# EasyEDA Pro project spark-switch.epro, schematic ethernet_switch

## Sheets
1 RJ45 Ports: Board Name: ethernet_switch; Create Date: 2026-02-01; Page Name: RJ45 Ports; Project Name: ethernet_switch; Schematic Name: ethernet_switch; Update Date: 2026-02-21; Company: EasyEDA.com; Page Size: A4; Version: V1.0
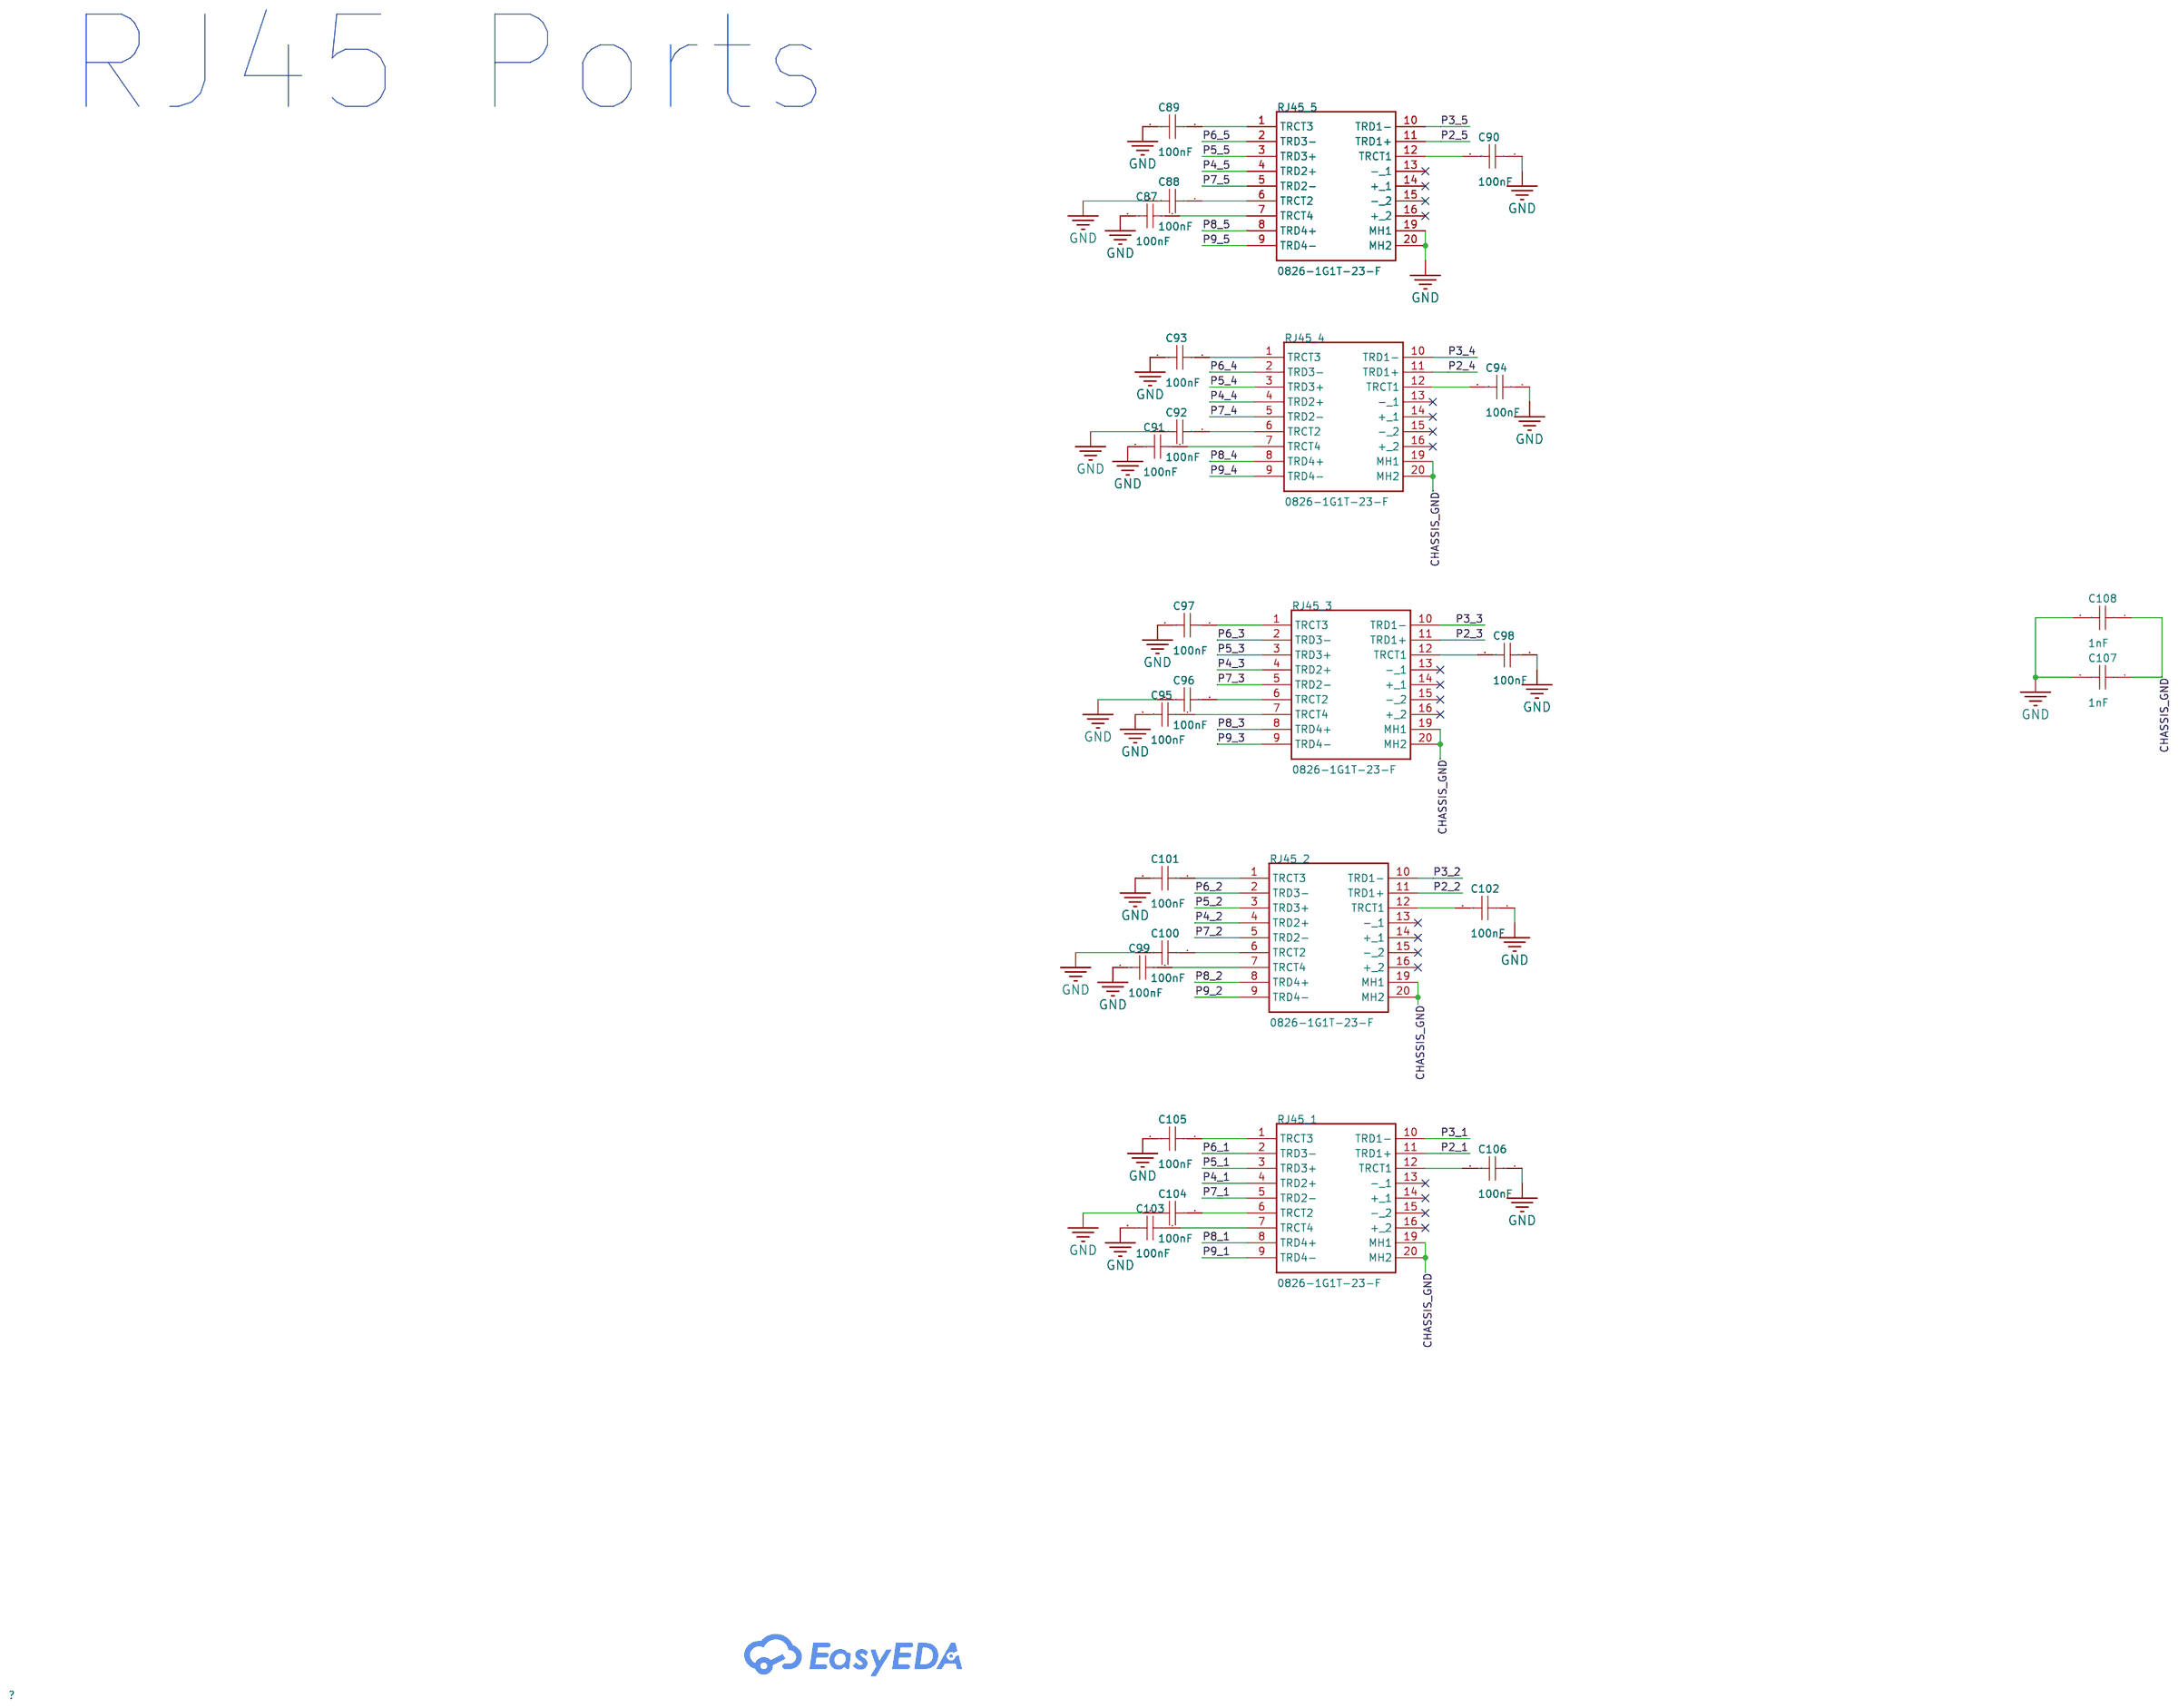
[diagram p0: RJ45 Ports]
2 Switch IC: Create Date: 2026-02-02; Page Name: Switch IC; Update Date: 2026-02-22
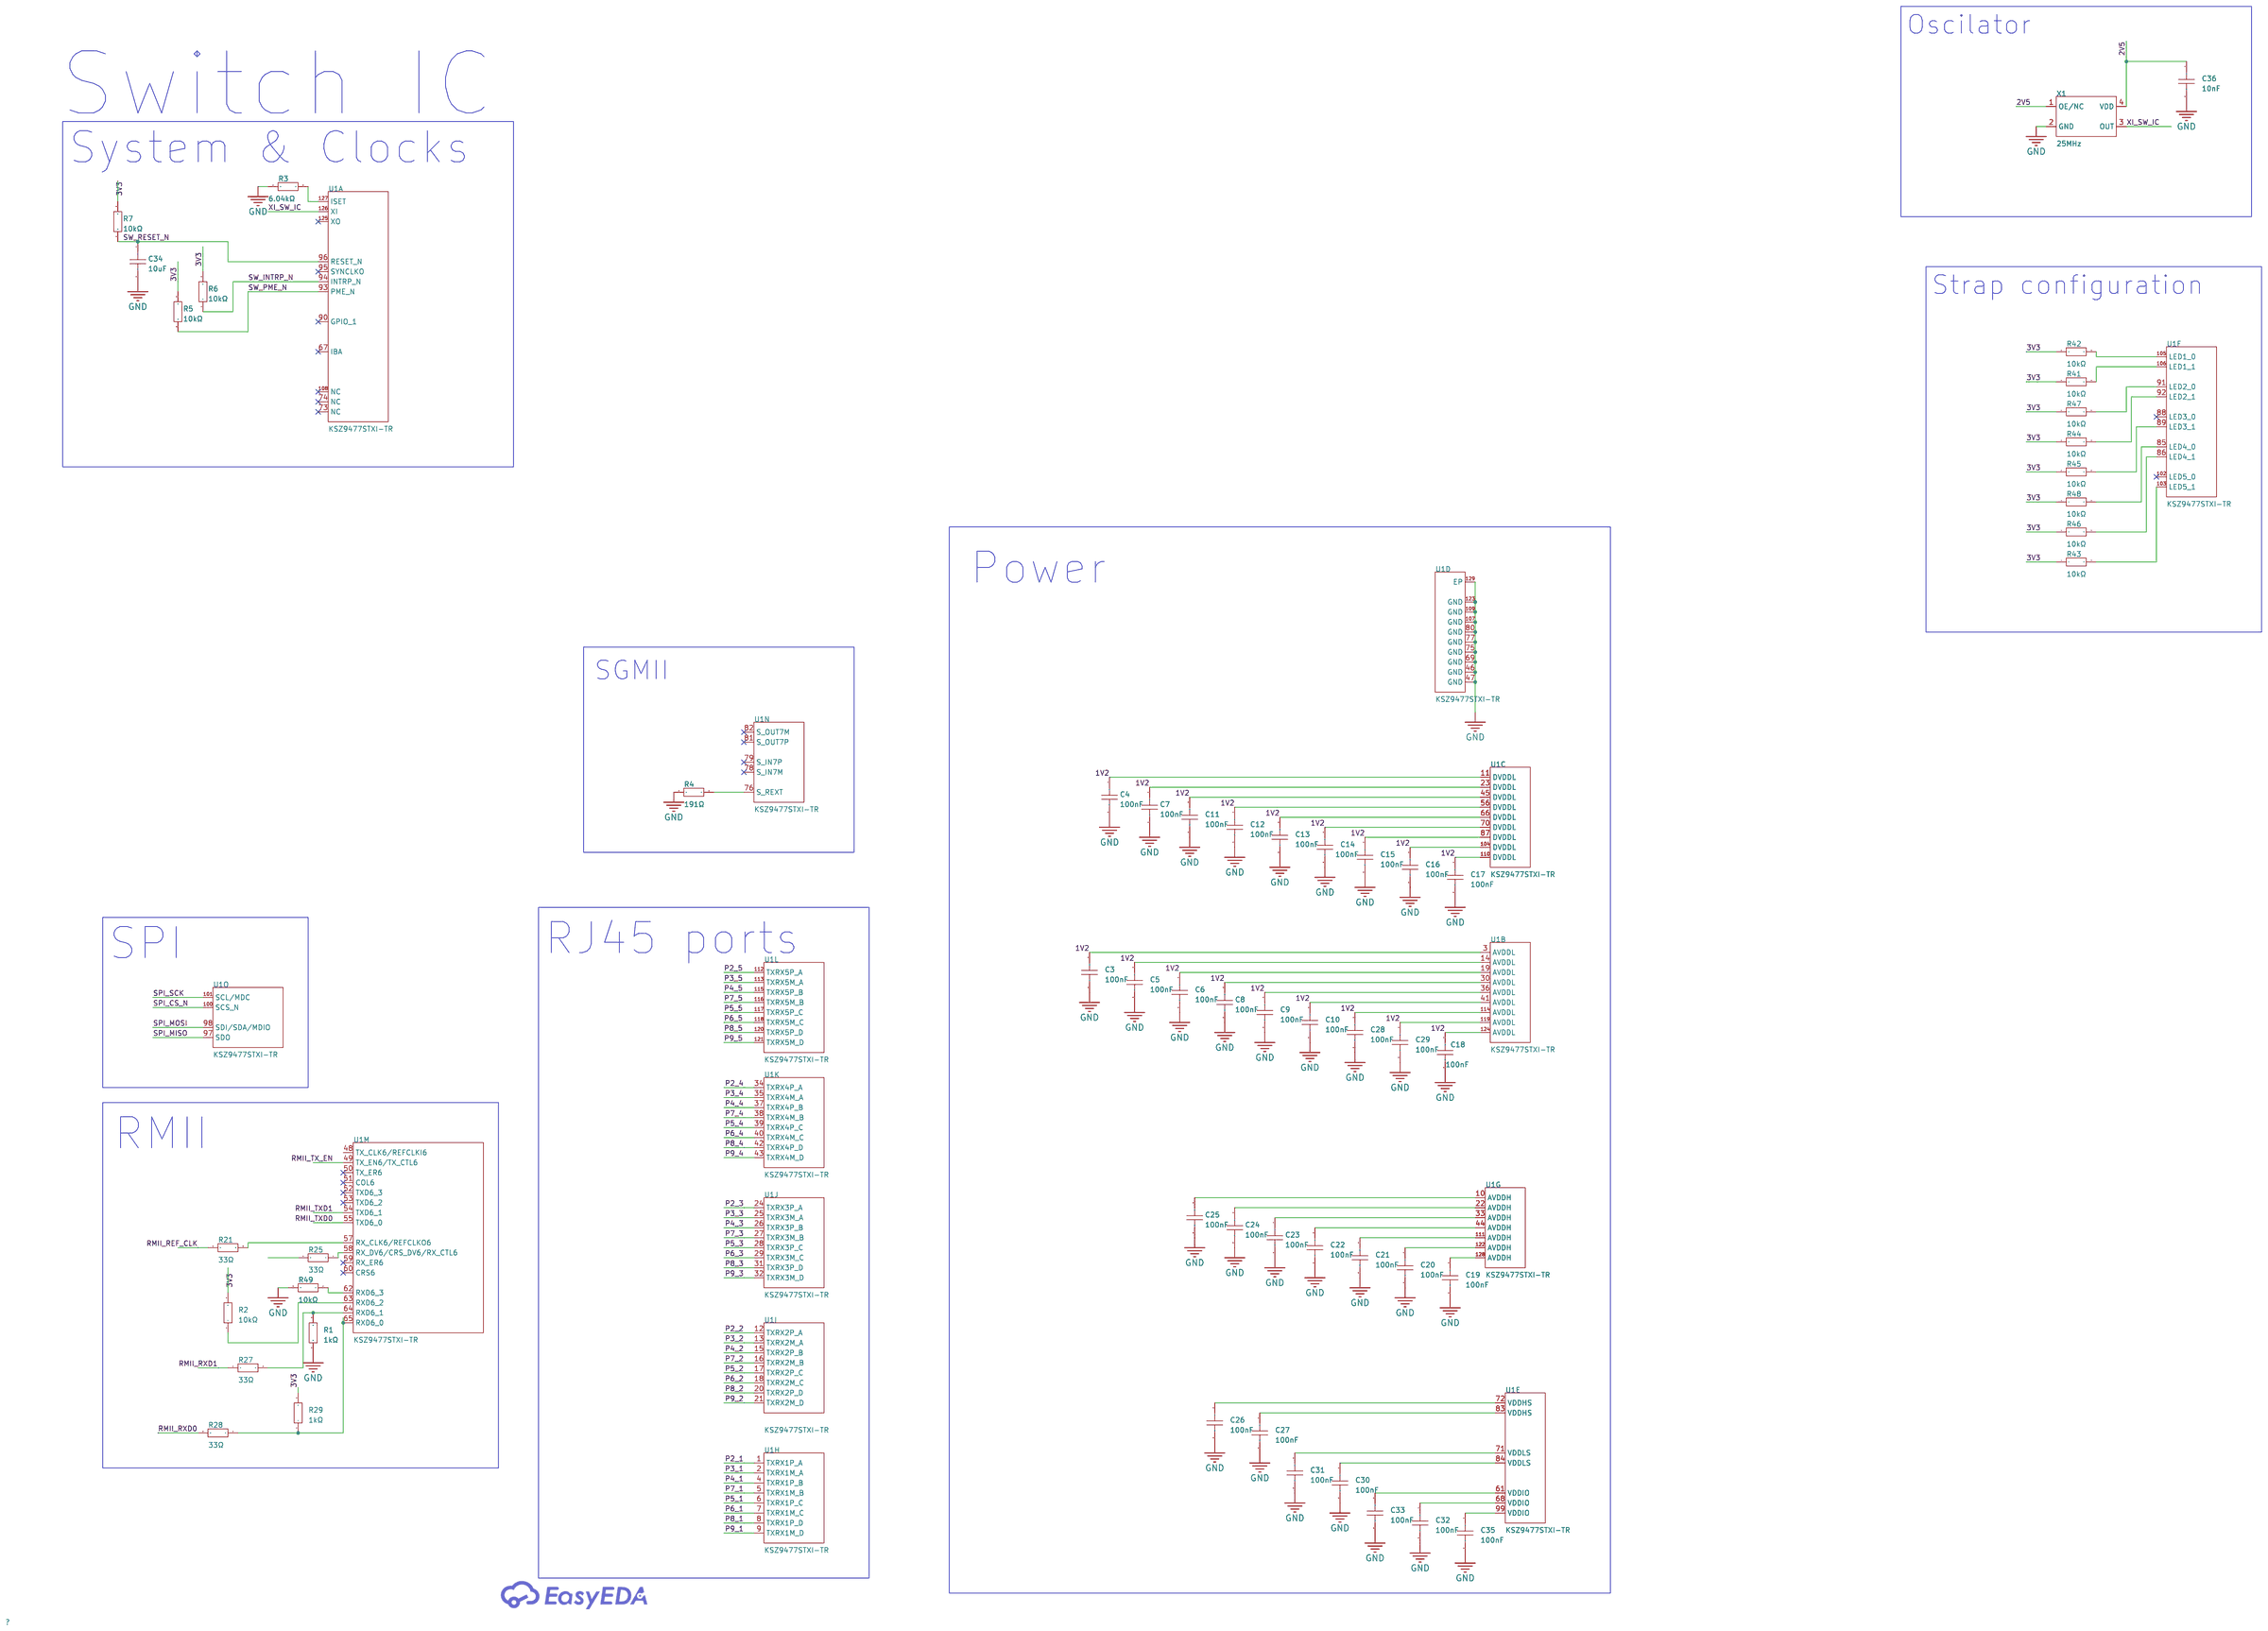
[diagram p1: Switch IC]
3 MCU: Create Date: 2026-02-02; Page Name: MCU; Update Date: 2026-02-22
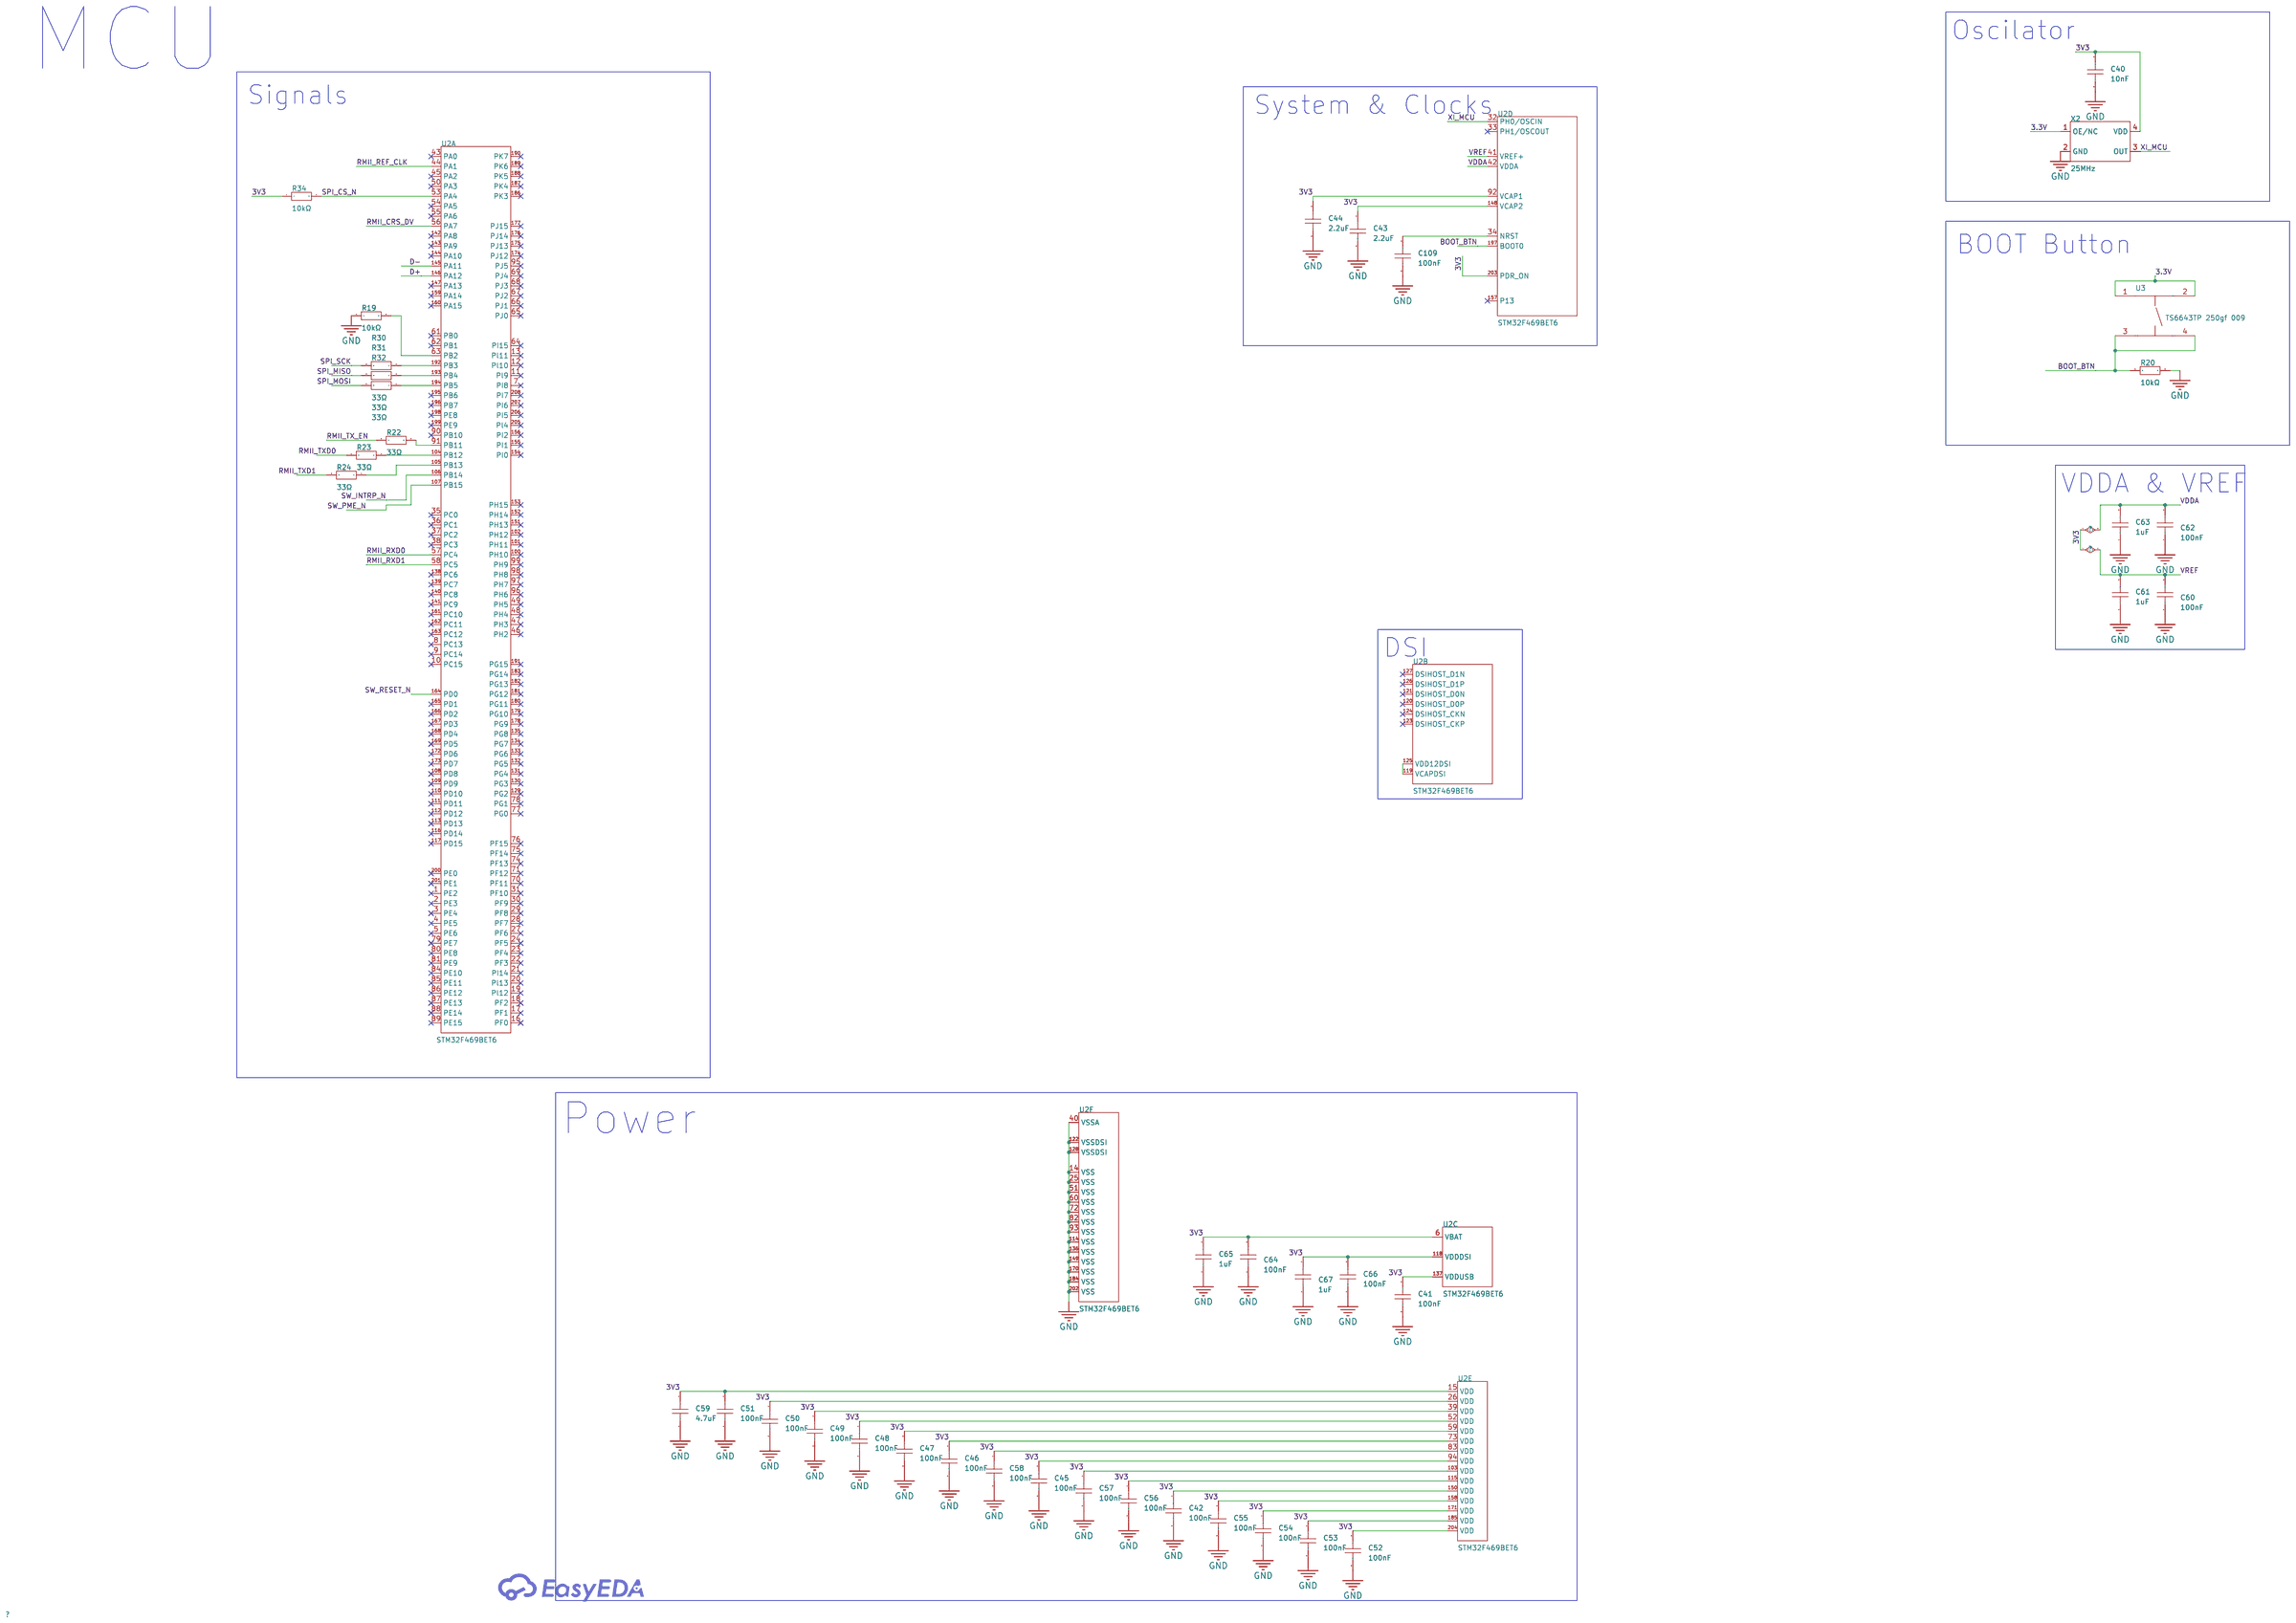
[diagram p2: MCU]
4 Power: Create Date: 2026-02-14; Page Name: Power; Update Date: 2026-02-18
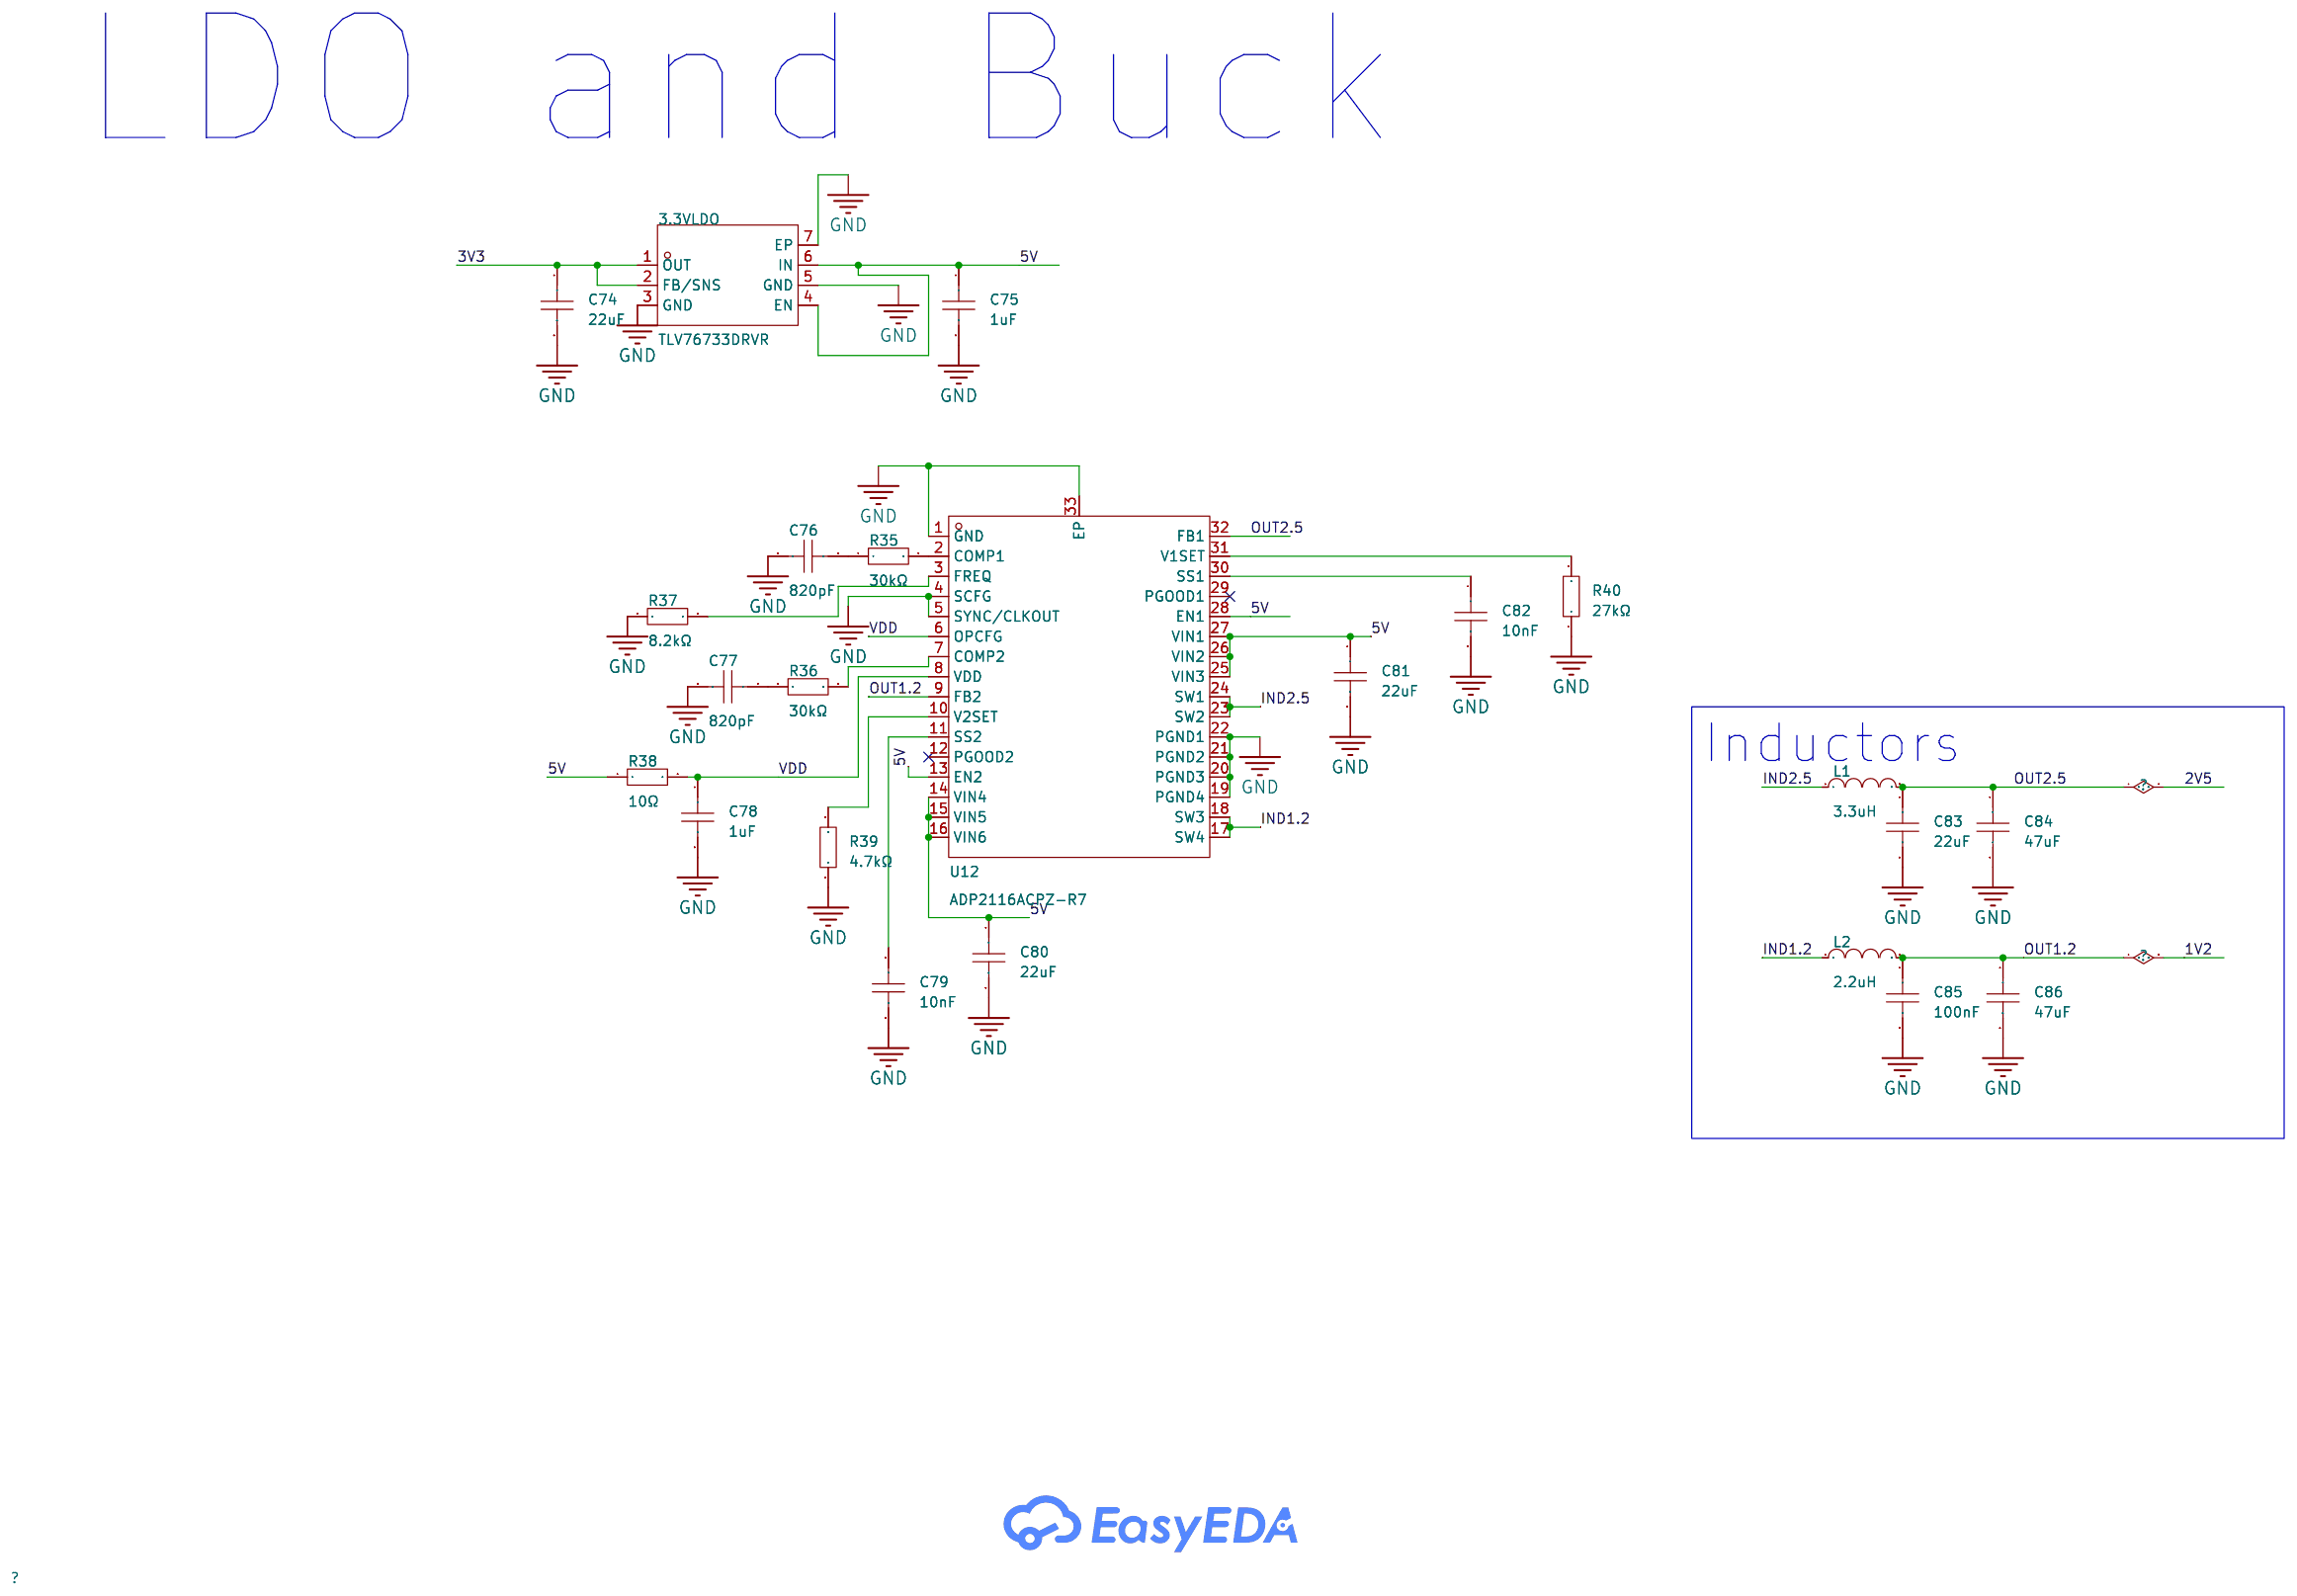
[diagram p3: Power]
5 USB+ESD: Create Date: 2026-02-15; Page Name: USB+ESD; Update Date: 2026-02-17
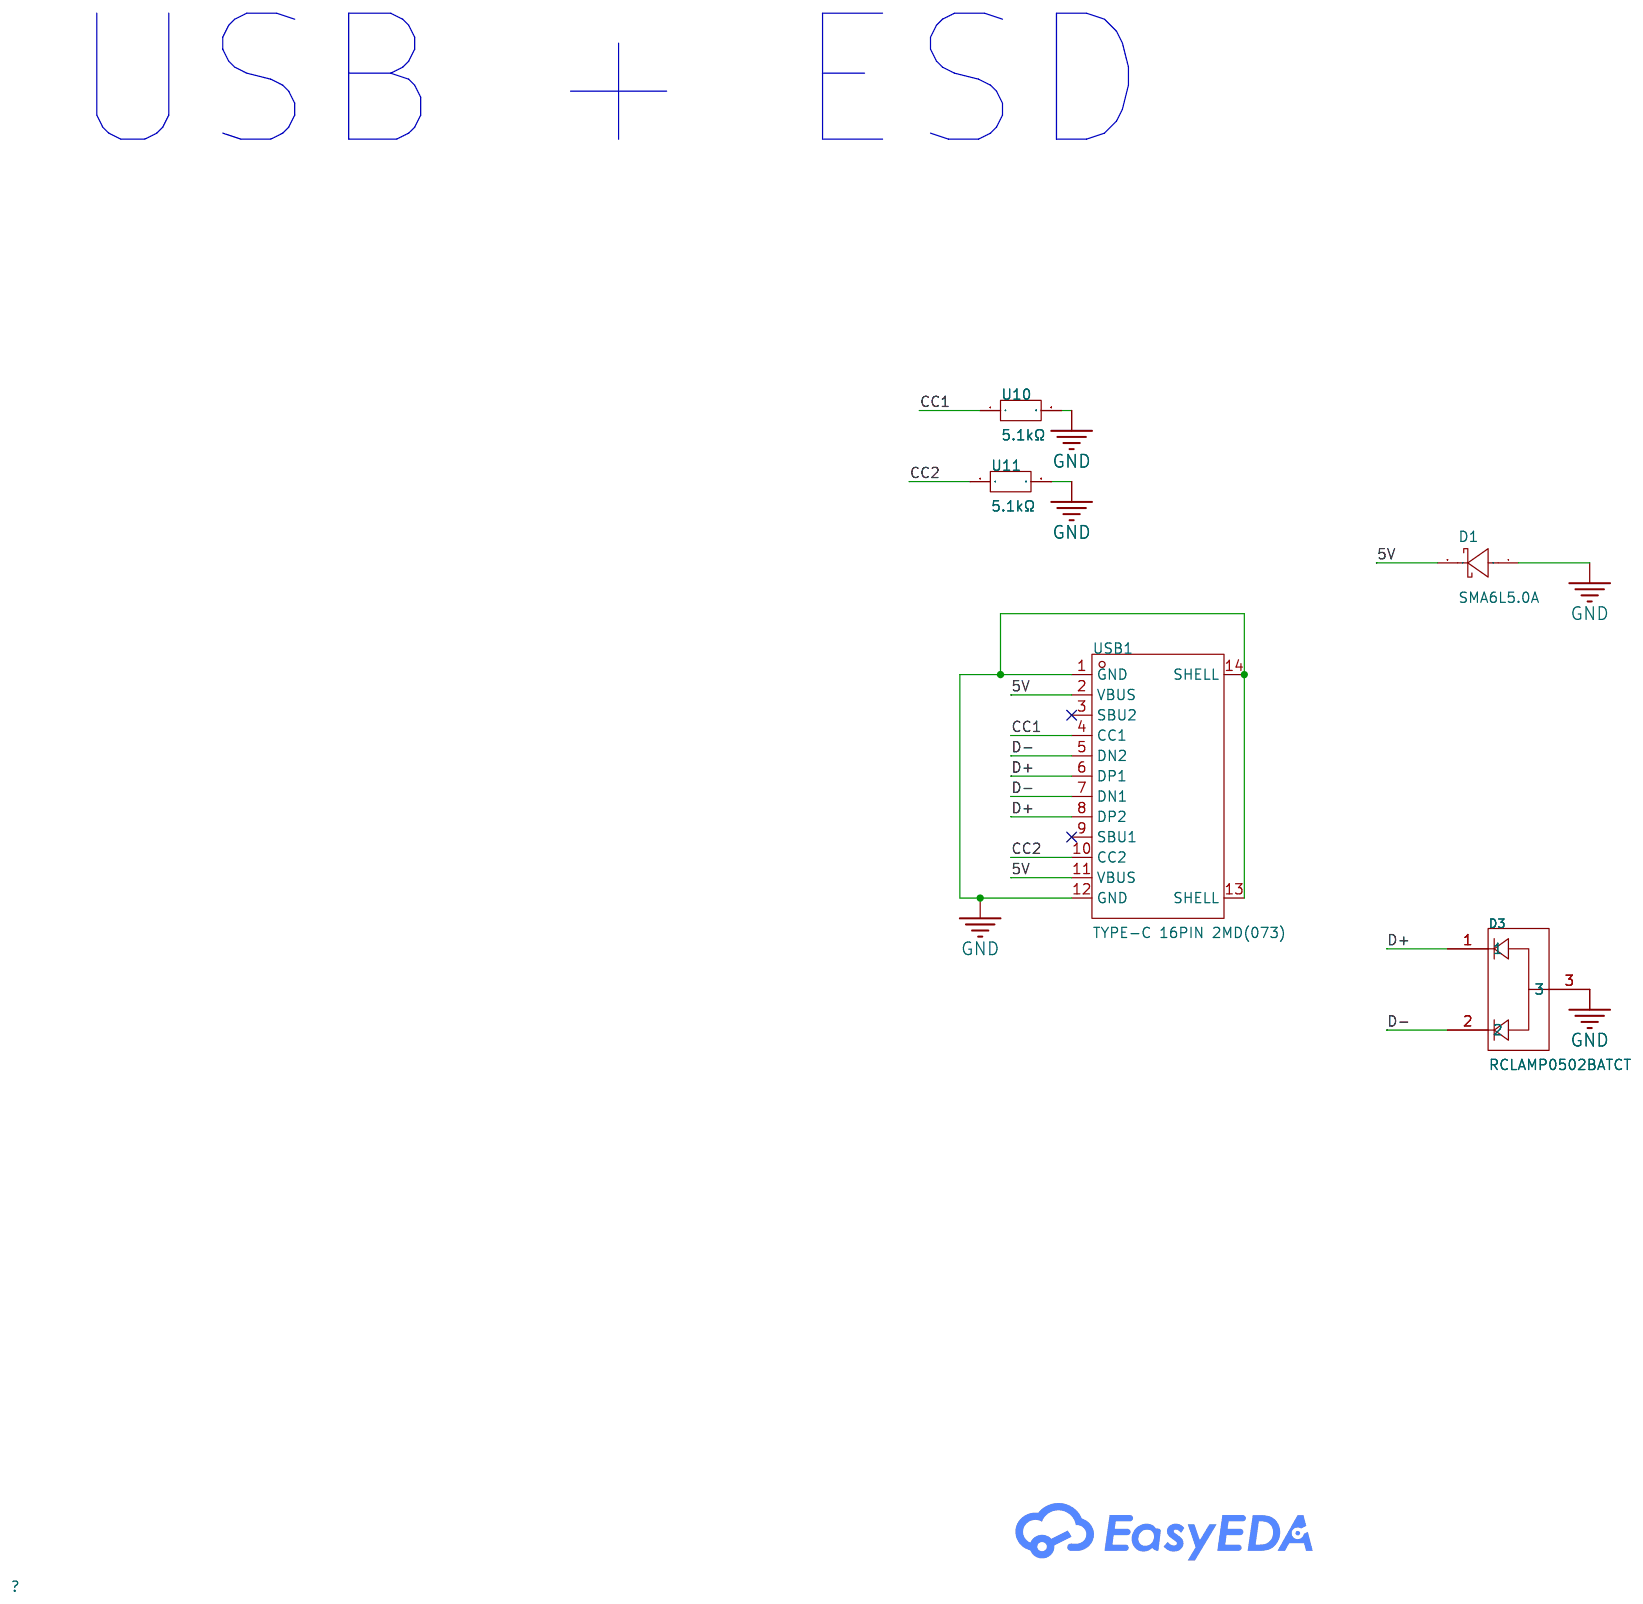
[diagram p4: USB+ESD]

## Parts
sheet MCU
C40  10nF  [C0603]
C41  100nF  [C0603]
C42  100nF  [C0603]
C43  2.2uF  [C0603]
C44  2.2uF  [C0603]
C45  100nF  [C0603]
C46  100nF  [C0603]
C47  100nF  [C0603]
C48  100nF  [C0603]
C49  100nF  [C0603]
C50  100nF  [C0603]
C51  100nF  [C0603]
C52  100nF  [C0603]
C53  100nF  [C0603]
C54  100nF  [C0603]
C55  100nF  [C0603]
C56  100nF  [C0603]
C57  100nF  [C0603]
C58  100nF  [C0603]
C59  4.7uF  [C0603]
C60  100nF  [C0603]
C61  1uF  [C0603]
C62  100nF  [C0603]
C63  1uF  [C0603]
C64  100nF  [C0603]
C65  1uF  [C0603]
C66  100nF  [C0603]
C67  1uF  [C0603]
C109  100nF  [C0603]
R19  10kΩ  [R0603]
R20  10kΩ  [R0603]
R22  33Ω  [R0603]
R23  33Ω  [R0603]
R24  33Ω  [R0603]
R30  33Ω  [R0603]
R31  33Ω  [R0603]
R32  33Ω  [R0603]
R34  10kΩ  [R0603]
U2  STM32F469BET6  [LQFP-208_L28.0-W28.0-P0.50-LS30.0-BL]  (sections 1,DSI,Other_Power,System_&_Clocks,VDD,VSS)
U3  TS6643TP 250gf 009  [SW-SMD_4P-L6.2-W6.0-P4.50-LS9.0]
X2  25MHz  [OSC-SMD_4P-L2.0-W1.6-BL_8NE]
sheet Power
3.3VLDO  TLV76733DRVR  [WSON-6_L2.0-W2.0-P0.65-TL-EP]
C74  22uF  [C0603]
C75  1uF  [C0603]
C76  820pF  [C0603]
C77  820pF  [C0603]
C78  1uF  [C0603]
C79  10nF  [C0603]
C80  22uF  [C0603]
C81  22uF  [C0603]
C82  10nF  [C0603]
C83  22uF  [C1210]
C84  47uF  [C1210]
C85  100nF  [C1210]
C86  47uF  [C1210]
L1  3.3uH  [IND-SMD_L5.5-W5.3]
L2  2.2uH  [IND-SMD_L5.4-W5.2]
R35  30kΩ  [R0603]
R36  30kΩ  [R0603]
R37  8.2kΩ  [R0603]
R38  10Ω  [R0603]
R39  4.7kΩ  [R0603]
R40  27kΩ  [R0603]
U12  ADP2116ACPZ-R7  [LFCSP-32_L5.0-W5.0-P0.50-BL-EP3.1]
sheet RJ45 Ports
C87  100nF  [C0603]
C88  100nF  [C0603]
C89  100nF  [C0603]
C90  100nF  [C0603]
C91  100nF  [C0603]
C92  100nF  [C0603]
C93  100nF  [C0603]
C94  100nF  [C0603]
C95  100nF  [C0603]
C96  100nF  [C0603]
C97  100nF  [C0603]
C98  100nF  [C0603]
C99  100nF  [C0603]
C100  100nF  [C0603]
C101  100nF  [C0603]
C102  100nF  [C0603]
C103  100nF  [C0603]
C104  100nF  [C0603]
C105  100nF  [C0603]
C106  100nF  [C0603]
C107  1nF  [C1808]
C108  1nF  [C1808]
RJ45_1  0826-1G1T-23-F  [08261G1T23F]
RJ45_2  0826-1G1T-23-F  [08261G1T23F]
RJ45_3  0826-1G1T-23-F  [08261G1T23F]
RJ45_4  0826-1G1T-23-F  [08261G1T23F]
RJ45_5  0826-1G1T-23-F  [08261G1T23F]
sheet Switch IC
C3  100nF  [C0603]
C4  100nF  [C0603]
C5  100nF  [C0603]
C6  100nF  [C0603]
C7  100nF  [C0603]
C8  100nF  [C0603]
C9  100nF  [C0603]
C10  100nF  [C0603]
C11  100nF  [C0603]
C12  100nF  [C0603]
C13  100nF  [C0603]
C14  100nF  [C0603]
C15  100nF  [C0603]
C16  100nF  [C0603]
C17  100nF  [C0603]
C18  100nF  [C0603]
C19  100nF  [C0603]
C20  100nF  [C0603]
C21  100nF  [C0603]
C22  100nF  [C0603]
C23  100nF  [C0603]
C24  100nF  [C0603]
C25  100nF  [C0603]
C26  100nF  [C0603]
C27  100nF  [C0603]
C28  100nF  [C0603]
C29  100nF  [C0603]
C30  100nF  [C0603]
C31  100nF  [C0603]
C32  100nF  [C0603]
C33  100nF  [C0603]
C34  10uF  [C0603]
C35  100nF  [C0603]
C36  10nF  [C0603]
R1  1kΩ  [R0603]
R2  10kΩ  [R0603]
R3  6.04kΩ  [R0603]
R4  191Ω  [R0603]
R5  10kΩ  [R0603]
R6  10kΩ  [R0603]
R7  10kΩ  [R0603]
R21  33Ω  [R0603]
R25  33Ω  [R0603]
R27  33Ω  [R0603]
R28  33Ω  [R0603]
R29  1kΩ  [R0603]
R41  10kΩ  [R0603]
R42  10kΩ  [R0603]
R43  10kΩ  [R0603]
R44  10kΩ  [R0603]
R45  10kΩ  [R0603]
R46  10kΩ  [R0603]
R47  10kΩ  [R0603]
R48  10kΩ  [R0603]
R49  10kΩ  [R0603]
U1  KSZ9477STXI-TR  [TQFP-128_L14.0-W14.0-P0.40-LS16.0-BL-EP]  (sections 1,Analog_Core_Power,Digital_Core_Power,GND,Interfaces_Power,LED,PHY1,PHY2,PHY3,PHY4,PHY5,PHY_&_Clock_Power,Port_6,SGMII,SPI)
X1  25MHz  [OSC-SMD_4P-L2.0-W1.6-BL_8NE]
sheet USB+ESD
D1  SMA6L5.0A  [SMA_L4.3-W2.6-LS5.2-R-RD]
D3  RCLAMP0502BATCT  [SC-75-3_L1.6-W0.8-P1.00-LS1.6-BR]
U10  5.1kΩ  [R0603]
U11  5.1kΩ  [R0603]
USB1  TYPE-C 16PIN 2MD(073)  [USB-C-SMD_TYPE-C-6PIN-2MD-073]

## Library data of the parts
C36 C40 C79 C82 = CC0603JRNPO8BN103: Capacitance:10nF Tolerance:±5% Tolerance:±5% Voltage Rating:25V Temperature Coefficient:NP0; LCSC Part Name: 10nF ±5% 25V; Supplier Part: C723749; Manufacturer: YAGEO(国巨); Supplier Footprint: 0603; JLCPCB Part Class: Extended Part; Datasheet: https://item.szlcsc.com/datasheet/CC0603JRNPO8BN103/768440.html; Supplier: LCSC; Tolerance: ±5%; Voltage Rating: 25V; Temperature Coefficient: NP0
C3-C33 C35 C41 C42 C45-C58 C60 C62 C64 C66 = CL10B104KA8NNNC: Capacitance:100nF Tolerance:±10% Tolerance:±10% Voltage Rating:25V Temperature Coefficient:X7R; LCSC Part Name: 100nF ±10% 25V; Supplier Part: C1590; Manufacturer: SAMSUNG(三星); Supplier Footprint: 0603; JLCPCB Part Class: Extended Part; Datasheet: https://item.szlcsc.com/datasheet/CL10B104KA8NNNC/1942.html; Supplier: LCSC; Tolerance: ±10%; Voltage Rating: 25V; Temperature Coefficient: X7R
C43 C44 = CGA0603X5R225K250JT: Capacitance:2.2uF Tolerance:±10% Tolerance:±10% Voltage Rating:25V Temperature Coefficient:X5R; LCSC Part Name: 2.2uF ±10% 25V; Supplier Part: C6119859; Manufacturer: HRE(芯声); Supplier Footprint: 0603; JLCPCB Part Class: Extended Part; Datasheet: https://item.szlcsc.com/datasheet/CGA0603X5R225K250JT/7062565.html; Supplier: LCSC; Tolerance: ±10%; Voltage Rating: 25V; Temperature Coefficient: X5R
C59 = CL10A475KA8NQNC: Capacitance:4.7uF Tolerance:±10% Tolerance:±10% Voltage Rating:25V Temperature Coefficient:X5R; LCSC Part Name: 4.7uF ±10% 25V; Supplier Part: C69335; Manufacturer: SAMSUNG(三星); Supplier Footprint: 0603; JLCPCB Part Class: Extended Part; Datasheet: https://item.szlcsc.com/datasheet/CL10A475KA8NQNC/70449.html; Supplier: LCSC; Tolerance: ±10%; Voltage Rating: 25V; Temperature Coefficient: X5R
C61 C63 C65 C67 C75 C78 = CL10B105KB8NQNC: Capacitance:1uF Tolerance:±10% Tolerance:±10% Voltage Rating:50V Temperature Coefficient:X7R; LCSC Part Name: 1uF ±10% 50V; Supplier Part: C5199872; Manufacturer: SAMSUNG(三星); Supplier Footprint: 0603; JLCPCB Part Class: Extended Part; Datasheet: https://item.szlcsc.com/datasheet/CL10B105KB8NQNC/5885909.html; Supplier: LCSC; Tolerance: ±10%; Voltage Rating: 50V; Temperature Coefficient: X7R
C87-C106 C109 = CAP_0603: Supplier Footprint: 0603
R2 R5-R7 R19 R20 R34 R41-R49 = RC0603FR-0710KL: Type:Thick Film Resistors Resistance: Tolerance:±1% Tolerance:±1% Power(Watts): Overload Voltage (Max): Temperature Coefficient:±100ppm/℃ Temperature Coefficient:±100ppm/℃ Operating Temperature Range:-55℃~+155℃ Operating Temperature Range:-55℃~+155℃; LCSC Part Name: 厚膜电阻 10kΩ ±1% 100mW; Supplier Part: C98220; Manufacturer: YAGEO(国巨); Supplier Footprint: 0603; JLCPCB Part Class: Extended Part; Datasheet: https://atta.szlcsc.com/upload/public/pdf/source/20180927/C295883_E8D83085EA81BD7DE0B2B681138C15EE.pdf; Supplier: LCSC; Type: Thick Film Resistors; Tolerance: ±1%; Temperature Coefficient: ±100ppm/℃; Operating Temperature Range: -55℃~+155℃
R21-R25 R27 R28 R30-R32 = FRC0603F33R0TS: Type:Thick Film Resistor Resistance:33Ω Tolerance:±1% Tolerance:±1% Power(Watts):100mW Voltage-Supply(Max):75V Temperature Coefficient:±100ppm/℃ Temperature Coefficient:±100ppm/℃ Operating Temperature:-55℃~+155℃ Operating Temperature:-55℃~+155℃; LCSC Part Name: 33Ω ±1% 100mW 厚膜电阻; Supplier Part: C2909394; Manufacturer: FOJAN(富捷); Supplier Footprint: 0603; JLCPCB Part Class: Extended Part; Supplier: LCSC; Type: Thick Film Resistor; Tolerance: ±1%; Power(Watts): 100mW; Voltage-Supply(Max): 75V; Temperature Coefficient: ±100ppm/℃; Operating Temperature: -55℃~+155℃
U2 = STM32F469BET6: CPU Core:ARM-M4 CPU Maximum Speed:180MHz Program Storage Size:512KB Program Memory Type:FLASH Number of I/O:161 ADC (Bit):12bit DAC (Bit):12bit Voltage - Supply:1.7V~3.6V Voltage - Supply:1.7V~3.6V Applications:-; LCSC Part Name: 带DSP和FPU的高性能高级系列ARM Cortex-M4 MCU，具有512 KB Flash、180 MHz CPU、ART加速器、Chrom-ART加速器、TFT、带SDRAM的FMC、双QSPI、TFT和MIPI-DSI; Supplier Part: C1342980; Manufacturer: ST(意法半导体); Supplier Footprint: LQFP-208(28x28); JLCPCB Part Class: Extended Part; Datasheet: https://item.szlcsc.com/datasheet/STM32F469BET6/1433262.html; Supplier: LCSC; CPU Core: ARM-M4; CPU Maximum Speed: 180MHz; Program Storage Size: 512KB; Program Memory Type: FLASH; Number of I/O: 161; ADC (Bit): 12bit; DAC (Bit): 12bit; Voltage - Supply: 1.7V~3.6V
U3 = TS6643TP 250gf 009: Circuit:SPST Actuator Style:Round Button Operating Force:2.5N Mounting Type:Surface Mount,Vertical Length:6mm Width:6mm Switch Height:4.3mm with Bracket:Without Bracket Contact Current:50mA Voltage Rating:12V Actuator/Cap Color:Black With Lamp:No IP Ratin; LCSC Part Name: 6*6*4.3mm 立贴 轻触开关; Supplier Part: C5342967; Manufacturer: SHOU HAN(首韩); Supplier Footprint: SMD,6x6mm; JLCPCB Part Class: Extended Part; Datasheet: https://item.szlcsc.com/datasheet/TS6643TP%2520250gf%2520009/6118870.html; Supplier: LCSC; Circuit: SPST; Actuator Style: Round Button; Operating Force: 2.5N; Mounting Type: Surface Mount,Vertical; Length: 6mm; Width: 6mm; Switch Height: 4.3mm; with Bracket: Without Bracket; Contact Current: 50mA; Voltage Rating: 12V; Actuator/Cap Color: Black; With Lamp: No; Life: 100,000 Cycles; Operating Temperature: -25℃~+70℃
X1 X2 = SX1M25.000M10F30TNN: Frequency:25MHz Normal temperature Frequency Tolerance:±10ppm Normal temperature Frequency Tolerance:±10ppm Output Type:CMOS Voltage - Supply:1.62V~3.63V Voltage - Supply:1.62V~3.63V Current - Supply:10mA Frequency Stability:±30ppm Frequency Stability:±30; LCSC Part Name: 25MHz ±10ppm 1.62V~3.63V CMOS; Supplier Part: C2901612; Manufacturer: SCTF(星通时频); Supplier Footprint: SMD2016-4P; JLCPCB Part Class: Extended Part; Datasheet: https://item.szlcsc.com/datasheet/SX1M25.000M10F30TNN/3151425.html; Supplier: LCSC; Normal temperature Frequency Tolerance: ±10ppm; Output Type: CMOS; Voltage - Supply: 1.62V~3.63V; Current - Supply: 10mA; Frequency Stability: ±30ppm; Operating Temperature: -40℃~+85℃
3.3VLDO = TLV76733DRVR: Output Type:Fixed Maximum Input Voltage:16V Output Voltage:3.3V Output Voltage:3.3V Output Current:1A Power Supply Rejection Ratio (PSRR):70dB@(120Hz) Dropout Voltage:1.4V@(1A) standby current:80uA Feature:防静电保护；Soft Start；浪涌保护；低ESR；Thermal Protection(TSD; LCSC Part Name: 具有可调节输出和固定输出的 1A、16V 正电压低压降 (LDO) 线性稳压器; Supplier Part: C2848334; Manufacturer: TI(德州仪器); Supplier Footprint: WSON-6(2x2); JLCPCB Part Class: Extended Part; Datasheet: https://www.ti.com/cn/lit/gpn/tlv767; Supplier: LCSC; Output Type: Fixed; Maximum Input Voltage: 16V; Output Voltage: 3.3V; Output Current: 1A; Power Supply Rejection Ratio (PSRR): 70dB@(120Hz); Dropout Voltage: 1.4V@(1A); standby current: 80uA; Feature: 防静电保护；Soft Start；浪涌保护；低ESR；Thermal Protection(TSD)；欠压闭锁；Overcurrent Protection(OCP)；带使能；防倒灌; Operating Temperature: -40℃~+125℃@(Tj); Output Polarity: Positive electrode; Number of Outputs: 1
C74 C80 C81 = GRM188C61E226ME01D: Capacitance:22uF Tolerance:±20% Tolerance:±20% Voltage Rating:25V; LCSC Part Name: 22uF ±20% 25V; Supplier Part: C29519229; Manufacturer: muRata(村田); Supplier Footprint: 0603; JLCPCB Part Class: Extended Part; Datasheet: https://item.szlcsc.com/datasheet/GRM188C61E226ME01D/31245821.html; Supplier: LCSC; Tolerance: ±20%; Voltage Rating: 25V
C76 C77 = CC0603JRNPO8BN821: Capacitance:820pF Tolerance:±5% Tolerance:±5% Voltage Rating:25V Temperature Coefficient:NP0; LCSC Part Name: 820pF ±5% 25V; Supplier Part: C519398; Manufacturer: YAGEO(国巨); Supplier Footprint: 0603; JLCPCB Part Class: Extended Part; Datasheet: https://item.szlcsc.com/datasheet/CC0603JRNPO8BN821/536069.html; Supplier: LCSC; Tolerance: ±5%; Voltage Rating: 25V; Temperature Coefficient: NP0
C83 = CL32B226KAJNNNE: Capacitance:22uF Tolerance:±10% Tolerance:±10% Voltage Rating:25V Temperature Coefficient:X7R; LCSC Part Name: 22uF ±10% 25V; Supplier Part: C309062; Manufacturer: SAMSUNG(三星); Supplier Footprint: 1210; JLCPCB Part Class: Extended Part; Datasheet: https://item.szlcsc.com/datasheet/CL32B226KAJNNNE/292813.html; Supplier: LCSC; Tolerance: ±10%; Voltage Rating: 25V; Temperature Coefficient: X7R
C84 C86 = CS3225X7R476K100NRL: Capacitance:47uF Tolerance:±10% Tolerance:±10% Voltage Rating:10V Temperature Coefficient:X7R; LCSC Part Name: 47uF ±10% 10V; Supplier Part: C5189825; Manufacturer: SAMWHA(三和); Supplier Footprint: 1210; JLCPCB Part Class: Extended Part; Datasheet: https://item.szlcsc.com/datasheet/CS3225X7R476K100NRL/5869646.html; Supplier: LCSC; Tolerance: ±10%; Voltage Rating: 10V; Temperature Coefficient: X7R
C85 = C3225C0G1H104JT000N: Capacitance:100nF Tolerance:±5% Tolerance:±5% Voltage Rating:50V Temperature Coefficient:C0G; LCSC Part Name: 100nF ±5% 50V; Supplier Part: C338021; Manufacturer: TDK; Supplier Footprint: 1210; JLCPCB Part Class: Extended Part; Datasheet: https://item.szlcsc.com/datasheet/C3225C0G1H104JT000N/315814.html; Supplier: LCSC; Tolerance: ±5%; Voltage Rating: 50V; Temperature Coefficient: C0G
L1 = FEXL0530A-3R3M: Inductance:3.3uH Tolerance:±20% Tolerance:±20% Current Rating:8.1A Current - Saturation(Isat):9.5A DC Resistance(DCR):23.1mΩ Type:- Ratings:AEC-Q200; LCSC Part Name: 3.3uH ±20% 9.5A 合金扁线超大电流，一体成型电感; Supplier Part: C5378512; Manufacturer: cjiang(长江微电); Supplier Footprint: SMD,5.3x5.5mm; JLCPCB Part Class: Extended Part; Datasheet: https://item.szlcsc.com/datasheet/FEXL0530A-3R3M/6241704.html; Supplier: LCSC; Tolerance: ±20%; Current Rating: 8.1A; Current - Saturation(Isat): 9.5A; DC Resistance(DCR): 23.1mΩ; Ratings: AEC-Q200
L2 = APH0530T2R2M: Inductance:2.2uH Tolerance:±20% Tolerance:±20% Current Rating:7A Current - Saturation(Isat):7A DC Resistance(DCR):29mΩ Type:Molded Inductor Ratings:-; LCSC Part Name: 2.2uH ±20% 7A; Supplier Part: C5349681; Manufacturer: APV(爱普微); Supplier Footprint: SMD,5.4x5.2mm; JLCPCB Part Class: Extended Part; Datasheet: https://item.szlcsc.com/datasheet/APH0530T2R2M/6135096.html; Supplier: LCSC; Tolerance: ±20%; Current Rating: 7A; Current - Saturation(Isat): 7A; DC Resistance(DCR): 29mΩ; Type: Molded Inductor
R35 R36 = FRC0603F3002TS: Type:Thick Film Resistor Resistance:30kΩ Tolerance:±1% Tolerance:±1% Power(Watts):100mW Voltage-Supply(Max):75V Temperature Coefficient:±100ppm/℃ Temperature Coefficient:±100ppm/℃ Operating Temperature:-55℃~+155℃ Operating Temperature:-55℃~+155℃; LCSC Part Name: 30kΩ ±1% 100mW 厚膜电阻; Supplier Part: C2907025; Manufacturer: FOJAN(富捷); Supplier Footprint: 0603; JLCPCB Part Class: Extended Part; Supplier: LCSC; Type: Thick Film Resistor; Tolerance: ±1%; Power(Watts): 100mW; Voltage-Supply(Max): 75V; Temperature Coefficient: ±100ppm/℃; Operating Temperature: -55℃~+155℃
R37 = RC0603FR-078K2L: Type:Thick Film Resistors Resistance: Tolerance:±1% Tolerance:±1% Power(Watts): Overload Voltage (Max): Temperature Coefficient:±100ppm/℃ Temperature Coefficient:±100ppm/℃ Operating Temperature Range:-55℃~+155℃ Operating Temperature Range:-55℃~+155℃; LCSC Part Name: 厚膜电阻 8.2kΩ ±1% 100mW; Supplier Part: C114637; Manufacturer: YAGEO(国巨); Supplier Footprint: 0603; JLCPCB Part Class: Extended Part; Datasheet: https://atta.szlcsc.com/upload/public/pdf/source/20180821/C275644_0D56F95EFF785E7D9A1FEF436B37DA78.pdf; Supplier: LCSC; Type: Thick Film Resistors; Tolerance: ±1%; Temperature Coefficient: ±100ppm/℃; Operating Temperature Range: -55℃~+155℃
R38 = FRC0603J100 TS: Type:Thick Film Resistor Resistance:10Ω Tolerance:±5% Tolerance:±5% Power(Watts):100mW Voltage-Supply(Max):75V Temperature Coefficient:±100ppm/℃ Temperature Coefficient:±100ppm/℃ Operating Temperature:-55℃~+155℃ Operating Temperature:-55℃~+155℃; LCSC Part Name: 10Ω ±5% 100mW 厚膜电阻; Supplier Part: C2907091; Manufacturer: FOJAN(富捷); Supplier Footprint: 0603; JLCPCB Part Class: Extended Part; Supplier: LCSC; Type: Thick Film Resistor; Tolerance: ±5%; Power(Watts): 100mW; Voltage-Supply(Max): 75V; Temperature Coefficient: ±100ppm/℃; Operating Temperature: -55℃~+155℃
R39 = RC0603FR-074K7L: Type:Thick Film Resistor Resistance:4.7kΩ Tolerance:±1% Tolerance:±1% Power(Watts):100mW Voltage-Supply(Max):75V Temperature Coefficient:±100ppm/℃ Temperature Coefficient:±100ppm/℃ Operating Temperature:-55℃~+155℃ Operating Temperature:-55℃~+155℃; LCSC Part Name: 厚膜电阻 4.7kΩ ±1% 100mW; Supplier Part: C99782; Manufacturer: YAGEO(国巨); Supplier Footprint: 0603; JLCPCB Part Class: Extended Part; Datasheet: https://item.szlcsc.com/datasheet/RC0603FR-074K7L/100996.html; Supplier: LCSC; Type: Thick Film Resistor; Tolerance: ±1%; Power(Watts): 100mW; Voltage-Supply(Max): 75V; Temperature Coefficient: ±100ppm/℃; Operating Temperature: -55℃~+155℃
R40 = RC0603FR-0727KL: Type:Thick Film Resistor Resistance:27kΩ Tolerance:±1% Tolerance:±1% Power(Watts):100mW Voltage-Supply(Max):75V Temperature Coefficient:±100ppm/℃ Temperature Coefficient:±100ppm/℃ Operating Temperature:-55℃~+155℃ Operating Temperature:-55℃~+155℃; LCSC Part Name: 厚膜电阻 27kΩ ±1% 100mW; Supplier Part: C114614; Manufacturer: YAGEO(国巨); Supplier Footprint: 0603; JLCPCB Part Class: Extended Part; Datasheet: https://item.szlcsc.com/datasheet/RC0603FR-0727KL/115858.html; Supplier: LCSC; Type: Thick Film Resistor; Tolerance: ±1%; Power(Watts): 100mW; Voltage-Supply(Max): 75V; Temperature Coefficient: ±100ppm/℃; Operating Temperature: -55℃~+155℃
U12 = ADP2116ACPZ-R7: Function:Buck Voltage - Supply:2.75V~5.5V Voltage - Supply:2.75V~5.5V Output Voltage:800mV；1.5V；1.2V；1.8V；2.5V；3.3V Output Voltage:800mV；1.5V；1.2V；1.8V；2.5V；3.3V Output Current:- Frequency - Switching:300kHz~1.2MHz Frequency - Switching:300kHz~1.2MHz Oper; LCSC Part Name: 降压型 2.75V~5.5V; Supplier Part: C659049; Manufacturer: ADI(亚德诺); Supplier Footprint: LFCSP-32(5x5); JLCPCB Part Class: Extended Part; Datasheet: https://item.szlcsc.com/datasheet/ADP2116ACPZ-R7/688500.html; Supplier: LCSC; Function: Buck; Voltage - Supply: 2.75V~5.5V; Output Voltage: 800mV；1.5V；1.2V；1.8V；2.5V；3.3V; Frequency - Switching: 300kHz~1.2MHz; Operating Temperature: -40℃~+125℃; Synchronous Rectifier: Yes; Number of Outputs: 2; Topology: Buck; Switch tube (built-in/external): Built-in; Output Type: Adjustable
C107 C108 = 1808B102K302NT: Capacitance:1nF Tolerance:±10% Tolerance:±10% Voltage Rating:3kV Temperature Coefficient:X7R; LCSC Part Name: 1nF ±10% 3kV; Supplier Part: C967608; Manufacturer: FH(风华); Supplier Footprint: 1808; JLCPCB Part Class: Extended Part; Datasheet: https://item.szlcsc.com/datasheet/1808B102K302NT/1054240.html; Supplier: LCSC; Tolerance: ±10%; Voltage Rating: 3kV; Temperature Coefficient: X7R
RJ45_1-RJ45_5 = 0826-1G1T-23-F
C34 = CL10A106MA8NRNC: Capacitance:10uF Tolerance:±20% Tolerance:±20% Voltage Rating:25V Temperature Coefficient:X5R; LCSC Part Name: 10uF ±20% 25V; Supplier Part: C96446; Manufacturer: SAMSUNG(三星); Supplier Footprint: 0603; JLCPCB Part Class: Basic Part; Datasheet: https://item.szlcsc.com/datasheet/CL10A106MA8NRNC/97651.html; Supplier: LCSC; Tolerance: ±20%; Voltage Rating: 25V; Temperature Coefficient: X5R
R1 R29 = FRC0603F1001TS: Type:Thick Film Resistor Resistance:1kΩ Tolerance:±1% Tolerance:±1% Power(Watts):100mW Voltage-Supply(Max):75V Temperature Coefficient:±100ppm/℃ Temperature Coefficient:±100ppm/℃ Operating Temperature:-55℃~+155℃ Operating Temperature:-55℃~+155℃; LCSC Part Name: 1kΩ ±1% 100mW 厚膜电阻; Supplier Part: C2907002; Manufacturer: FOJAN(富捷); Supplier Footprint: 0603; JLCPCB Part Class: Extended Part; Supplier: LCSC; Type: Thick Film Resistor; Tolerance: ±1%; Power(Watts): 100mW; Voltage-Supply(Max): 75V; Temperature Coefficient: ±100ppm/℃; Operating Temperature: -55℃~+155℃
R3 = 0603WAF6041T5E: Type:Thick Film Resistor Resistance:6.04kΩ Tolerance:±1% Tolerance:±1% Power(Watts):100mW Voltage-Supply(Max):75V Temperature Coefficient:±100ppm/℃ Temperature Coefficient:±100ppm/℃ Operating Temperature:-55℃~+155℃ Operating Temperature:-55℃~+155℃; LCSC Part Name: 6.04kΩ ±1% 100mW 厚膜电阻; Supplier Part: C25977; Manufacturer: UNI-ROYAL(厚声); Supplier Footprint: 0603; JLCPCB Part Class: Extended Part; Datasheet: https://item.szlcsc.com/datasheet/0603WAF6041T5E/26720.html; Supplier: LCSC; Type: Thick Film Resistor; Tolerance: ±1%; Power(Watts): 100mW; Voltage-Supply(Max): 75V; Temperature Coefficient: ±100ppm/℃; Operating Temperature: -55℃~+155℃
R4 = RMC06031911%N: Type:Thick Film Resistor Resistance:191Ω Tolerance:±1% Tolerance:±1% Power(Watts):100mW Voltage-Supply(Max):50V Temperature Coefficient:±100ppm/℃ Temperature Coefficient:±100ppm/℃ Operating Temperature:-55℃~+155℃ Operating Temperature:-55℃~+155℃; LCSC Part Name: 厚膜电阻 191Ω ±1% 100mW; Supplier Part: C269413; Manufacturer: Tyohm(幸亚电阻); Supplier Footprint: 0603; JLCPCB Part Class: Extended Part; Datasheet: https://item.szlcsc.com/datasheet/RMC06031911%2525N/258853.html; Supplier: LCSC; Type: Thick Film Resistor; Tolerance: ±1%; Power(Watts): 100mW; Voltage-Supply(Max): 50V; Temperature Coefficient: ±100ppm/℃; Operating Temperature: -55℃~+155℃
U1 = KSZ9477STXI-TR: Data Rate:1Gbps Operating Temperature:-40℃~+85℃ Operating Temperature:-40℃~+85℃; LCSC Part Name: KSZ9477S 7端口千兆以太网交换机，具有环冗余和SGMII及RGMII/MII/RMII接口; Supplier Part: C631685; Manufacturer: MICROCHIP(美国微芯); Supplier Footprint: TQFP-128(14x14); JLCPCB Part Class: Extended Part; Datasheet: https://atta.szlcsc.com/upload/public/pdf/source/20221017/4CE8014F039B9B45E8B1A7D3D5EE0DA3.pdf; Supplier: LCSC; Data Rate: 1Gbps; Operating Temperature: -40℃~+85℃
D1 = SMA6L5.0A: Polarity:Unidirectional Reverse Stand-Off Voltage (Vrwm):5V Clamping Voltage:9.2V Peak Pulse Current (Ipp):65.3A Peak Pulse Power Dissipation (Ppp):600W@10/1000us Voltage - Breakdown:6.4V Reverse Leakage Current (Ir):800uA Operating Temperature:-65℃~+150℃; LCSC Part Name: 5V截止 65.3A峰值脉冲; Supplier Part: C1974860; Manufacturer: Littelfuse(美国力特); Supplier Footprint: DO-221AC; JLCPCB Part Class: Extended Part; Datasheet: https://item.szlcsc.com/datasheet/SMA6L5.0A/2066398.html; Supplier: LCSC; Polarity: Unidirectional; Reverse Stand-Off Voltage (Vrwm): 5V; Clamping Voltage: 9.2V; Peak Pulse Current (Ipp): 65.3A; Peak Pulse Power Dissipation (Ppp): 600W@10/1000us; Voltage - Breakdown: 6.4V; Reverse Leakage Current (Ir): 800uA; Operating Temperature: -65℃~+150℃; level of protection: IEC 61000-4-4；IEC 61000-4-2; Type: TVS
D3 = RCLAMP0502BATCT: Polarity:Unidirectional Reverse Stand-Off Voltage (Vrwm):5V Clamping Voltage:25V Peak Pulse Current (Ipp):5A Voltage - Breakdown:6V Reverse Leakage Current (Ir):1uA level of protection:IEC 61000-4-4；IEC 61000-4-5；IEC 61000-4-2 Type:TVS Junction Capacitanc; LCSC Part Name: 单向ESD; Supplier Part: C117553; Manufacturer: SEMTECH; Supplier Footprint: SC-75(SOT-523); JLCPCB Part Class: Extended Part; Datasheet: https://item.szlcsc.com/datasheet/RCLAMP0502BATCT/118812.html; Supplier: LCSC; Polarity: Unidirectional; Reverse Stand-Off Voltage (Vrwm): 5V; Clamping Voltage: 25V; Peak Pulse Current (Ipp): 5A; Voltage - Breakdown: 6V; Reverse Leakage Current (Ir): 1uA; level of protection: IEC 61000-4-4；IEC 61000-4-5；IEC 61000-4-2; Type: TVS; Junction Capacitance: 0.5pF
U10 U11 = FRC0603F5101TS: Type:Thick Film Resistor Resistance:5.1kΩ Tolerance:±1% Tolerance:±1% Power(Watts):100mW Voltage-Supply(Max):75V Temperature Coefficient:±100ppm/℃ Temperature Coefficient:±100ppm/℃ Operating Temperature:-55℃~+155℃ Operating Temperature:-55℃~+155℃; LCSC Part Name: 5.1kΩ ±1% 100mW 厚膜电阻; Supplier Part: C2907044; Manufacturer: FOJAN(富捷); Supplier Footprint: 0603; JLCPCB Part Class: Extended Part; Supplier: LCSC; Type: Thick Film Resistor; Tolerance: ±1%; Power(Watts): 100mW; Voltage-Supply(Max): 75V; Temperature Coefficient: ±100ppm/℃; Operating Temperature: -55℃~+155℃
USB1 = TYPE-C 16PIN 2MD(073): Connector Type:Type-C Protocol Standard:- Gender:Female Mounting Type:Surface Mount, Right Angle Number of Contacts:16P Number of Ports:1 Current Rating-Power:3A Voltage Rating:5V Connect-Disconnect Life:5,000 times Supplementary Features:- Center Height:; LCSC Part Name: 16P卧贴母座; Supplier Part: C2765186; Manufacturer: SHOU HAN(首韩); Supplier Footprint: SMD; JLCPCB Part Class: Extended Part; Datasheet: https://item.szlcsc.com/datasheet/TYPE-C%252016PIN%25202MD(073)/2901843.html; Supplier: LCSC; Connector Type: Type-C; Gender: Female; Mounting Type: Surface Mount, Right Angle; Number of Contacts: 16P; Number of Ports: 1; Current Rating-Power: 3A; Voltage Rating: 5V; Connect-Disconnect Life: 5,000 times; Detection color: Black; Operating Temperature: -25℃~+85℃

## Nets
1V2: C3.1 C4.1 C5.1 C6.1 C7.1 C8.1 C9.1 C10.1 C11.1 C12.1 C13.1 C14.1 C15.1 C16.1 C17.1 C18.1 C28.1 C29.1 C85.1 C86.1 L2.2 U1.3(AVDDL) U1.11(DVDDL) U1.14(AVDDL) U1.19(AVDDL) U1.23(DVDDL) U1.30(AVDDL) U1.36(AVDDL) U1.41(AVDDL) U1.45(DVDDL) U1.56(DVDDL) U1.66(DVDDL) U1.70(DVDDL) U1.87(DVDDL) U1.104(DVDDL) U1.110(DVDDL) U1.114(AVDDL) U1.119(AVDDL) U1.124(AVDDL) U12.9(FB2)
2V5: C36.1 C83.1 C84.1 L1.2 U12.32(FB1) X1.1(OE/NC) X1.4(VDD)
3.3V: U3.1(A) U3.2(B) X2.1(OE/NC)
3V3: 3.3VLDO.1(OUT) 3.3VLDO.2(FB/SNS) C40.1 C41.1 C42.1 C43.1 C44.1 C45.1 C46.1 C47.1 C48.1 C49.1 C50.1 C51.1 C52.1 C53.1 C54.1 C55.1 C56.1 C57.1 C58.1 C59.1 C60.2 C61.2 C62.2 C63.2 C64.2 C65.2 C66.2 C67.2 C74.1 R2.2 R5.1 R6.2 R7.2 R29.2 R34.1 R41.1 R42.1 R43.1 R44.1 R45.1 R46.1 R47.1 R48.1 U2.6(VBAT) U2.15(VDD) U2.26(VDD) U2.39(VDD) U2.41(VREF+) U2.42(VDDA) U2.52(VDD) U2.59(VDD) U2.73(VDD) U2.83(VDD) U2.92(VCAP1) U2.94(VDD) U2.103(VDD) U2.115(VDD) U2.118(VDDDSI) U2.137(VDDUSB) U2.148(VCAP2) U2.150(VDD) U2.158(VDD) U2.171(VDD) U2.185(VDD) U2.203(PDR_ON) U2.204(VDD) X2.4(VDD)
5V: 3.3VLDO.4(EN) 3.3VLDO.6(IN) C75.1 C80.1 C81.1 D1.2(K) R38.1 U12.13(EN2) U12.14(VIN4) U12.15(VIN5) U12.16(VIN6) U12.25(VIN3) U12.26(VIN2) U12.27(VIN1) U12.28(EN1) USB1.2(VBUS) USB1.11(VBUS)
GND: 3.3VLDO.3(GND) 3.3VLDO.5(GND) 3.3VLDO.7(EP) C3.2 C4.2 C5.2 C6.2 C7.2 C8.2 C9.2 C10.2 C11.2 C12.2 C13.2 C14.2 C15.2 C16.2 C17.2 C18.2 C19.2 C20.2 C21.2 C22.2 C23.2 C24.2 C25.2 C26.2 C27.2 C28.2 C29.2 C30.2 C31.2 C32.2 C33.2 C34.2 C35.2 C36.2 C40.2 C41.2 C42.2 C43.2 C44.2 C45.2 C46.2 C47.2 C48.2 C49.2 C50.2 C51.2 C52.2 C53.2 C54.2 C55.2 C56.2 C57.2 C58.2 C59.2 C60.1 C61.1 C62.1 C63.1 C64.1 C65.1 C66.1 C67.1 C74.2 C75.2 C76.2 C77.2 C78.2 C79.2 C80.2 C81.2 C82.2 C83.2 C84.2 C85.2 C86.2 C87.2 C88.2 C89.2 C90.1 C91.2 C92.2 C93.2 C94.1 C95.2 C96.2 C97.2 C98.1 C99.2 C100.2 C101.2 C102.1 C103.2 C104.2 C105.2 C106.1 C107.2 C108.2 C109.2 D1.1(A) D3.3 R1.1 R3.1 R4.1 R19.1 R20.1 R37.1 R39.1 R40.1 R49.2 RJ45_5.19(MH1) RJ45_5.20(MH2) U1.46(GND) U1.47(GND) U1.69(GND) U1.75(GND) U1.77(GND) U1.80(GND) U1.107(GND) U1.109(GND) U1.123(GND) U1.129(EP) U2.14(VSS) U2.25(VSS) U2.40(VSSA) U2.51(VSS) U2.60(VSS) U2.72(VSS) U2.82(VSS) U2.93(VSS) U2.114(VSS) U2.122(VSSDSI) U2.128(VSSDSI) U2.136(VSS) U2.149(VSS) U2.170(VSS) U2.184(VSS) U2.202(VSS) U10.2 U11.2 U12.1(GND) U12.4(SCFG) U12.5(SYNC/CLKOUT) U12.19(PGND4) U12.20(PGND3) U12.21(PGND2) U12.22(PGND1) U12.33(EP) USB1.1(GND) USB1.12(GND) USB1.13(SHELL) USB1.14(SHELL) X1.2(GND) X2.2(GND)
VDD: C78.1 R38.2 U12.6(OPCFG) U12.8(VDD)
BOOT_BTN: R20.2 U2.197(BOOT0) U3.3(C) U3.4(D)
CC1: U10.1 USB1.4(CC1)
CC2: U11.1 USB1.10(CC2)
CHASSIS_GND: C107.1 C108.1 RJ45_1.19(MH1) RJ45_1.20(MH2) RJ45_2.19(MH1) RJ45_2.20(MH2) RJ45_3.19(MH1) RJ45_3.20(MH2) RJ45_4.19(MH1) RJ45_4.20(MH2)
D+: D3.1 U2.146(PA12) USB1.6(DP1) USB1.8(DP2)
D-: D3.2 U2.145(PA11) USB1.5(DN2) USB1.7(DN1)
IND1.2: L2.1 U12.17(SW4) U12.18(SW3)
IND2.5: L1.1 U12.23(SW2) U12.24(SW1)
P2_1: RJ45_1.11(TRD1+) U1.1(TXRX1P_A)
P2_2: RJ45_2.11(TRD1+) U1.12(TXRX2P_A)
P2_3: RJ45_3.11(TRD1+) U1.24(TXRX3P_A)
P2_4: RJ45_4.11(TRD1+) U1.34(TXRX4P_A)
P2_5: RJ45_5.11(TRD1+) U1.112(TXRX5P_A)
P3_1: RJ45_1.10(TRD1-) U1.2(TXRX1M_A)
P3_2: RJ45_2.10(TRD1-) U1.13(TXRX2M_A)
P3_3: RJ45_3.10(TRD1-) U1.25(TXRX3M_A)
P3_4: RJ45_4.10(TRD1-) U1.35(TXRX4M_A)
P3_5: RJ45_5.10(TRD1-) U1.113(TXRX5M_A)
P4_1: RJ45_1.4(TRD2+) U1.4(TXRX1P_B)
P4_2: RJ45_2.4(TRD2+) U1.15(TXRX2P_B)
P4_3: RJ45_3.4(TRD2+) U1.26(TXRX3P_B)
P4_4: RJ45_4.4(TRD2+) U1.37(TXRX4P_B)
P4_5: RJ45_5.4(TRD2+) U1.115(TXRX5P_B)
P5_1: RJ45_1.3(TRD3+) U1.6(TXRX1P_C)
P5_2: RJ45_2.3(TRD3+) U1.17(TXRX2P_C)
P5_3: RJ45_3.3(TRD3+) U1.28(TXRX3P_C)
P5_4: RJ45_4.3(TRD3+) U1.39(TXRX4P_C)
P5_5: RJ45_5.3(TRD3+) U1.117(TXRX5P_C)
P6_1: RJ45_1.2(TRD3-) U1.7(TXRX1M_C)
P6_2: RJ45_2.2(TRD3-) U1.18(TXRX2M_C)
P6_3: RJ45_3.2(TRD3-) U1.29(TXRX3M_C)
P6_4: RJ45_4.2(TRD3-) U1.40(TXRX4M_C)
P6_5: RJ45_5.2(TRD3-) U1.118(TXRX5M_C)
P7_1: RJ45_1.5(TRD2-) U1.5(TXRX1M_B)
P7_2: RJ45_2.5(TRD2-) U1.16(TXRX2M_B)
P7_3: RJ45_3.5(TRD2-) U1.27(TXRX3M_B)
P7_4: RJ45_4.5(TRD2-) U1.38(TXRX4M_B)
P7_5: RJ45_5.5(TRD2-) U1.116(TXRX5M_B)
P8_1: RJ45_1.8(TRD4+) U1.8(TXRX1P_D)
P8_2: RJ45_2.8(TRD4+) U1.20(TXRX2P_D)
P8_3: RJ45_3.8(TRD4+) U1.31(TXRX3P_D)
P8_4: RJ45_4.8(TRD4+) U1.42(TXRX4P_D)
P8_5: RJ45_5.8(TRD4+) U1.120(TXRX5P_D)
P9_1: RJ45_1.9(TRD4-) U1.9(TXRX1M_D)
P9_2: RJ45_2.9(TRD4-) U1.21(TXRX2M_D)
P9_3: RJ45_3.9(TRD4-) U1.32(TXRX3M_D)
P9_4: RJ45_4.9(TRD4-) U1.43(TXRX4M_D)
P9_5: RJ45_5.9(TRD4-) U1.121(TXRX5M_D)
RMII_CRS_DV: U2.56(PA7)
RMII_REF_CLK: R21.1 U2.44(PA1)
RMII_RXD0: R28.2 U2.57(PC4)
RMII_RXD1: R27.1 U2.58(PC5)
RMII_TX_EN: R22.1 U1.49(TX_EN6/TX_CTL6)
RMII_TXD0: R23.2 U1.55(TXD6_0)
RMII_TXD1: R24.2 U1.54(TXD6_1)
SPI_CS_N: R34.2 U1.100(SCS_N) U2.53(PA4)
SPI_MISO: R31.2 U1.97(SDO)
SPI_MOSI: R32.2 U1.98(SDI/SDA/MDIO)
SPI_SCK: R30.2 U1.101(SCL/MDC)
SW_INTRP_N: R6.1 U1.94(INTRP_N) U2.106(PB14)
SW_PME_N: R5.2 U1.93(PME_N) U2.107(PB15)
SW_RESET_N: C34.1 R7.1 U1.96(RESET_N) U2.164(PD0)
XI_MCU: U2.32(PH0/OSCIN) X2.3(OUT)
XI_SW_IC: U1.126(XI) X1.3(OUT)
$1N12786: C88.1 RJ45_5.6(TRCT2)
$1N12790: C87.1 RJ45_5.7(TRCT4)
$1N12844: C89.1 RJ45_5.1(TRCT3)
$1N12872: C90.2 RJ45_5.12(TRCT1)
$1N13168: C91.1 RJ45_4.7(TRCT4)
$1N13170: C92.1 RJ45_4.6(TRCT2)
$1N13174: C93.1 RJ45_4.1(TRCT3)
$1N13190: C94.2 RJ45_4.12(TRCT1)
$1N13450: C98.2 RJ45_3.12(TRCT1)
$1N13455: C96.1 RJ45_3.6(TRCT2)
$1N13457: C95.1 RJ45_3.7(TRCT4)
$1N13459: C97.1 RJ45_3.1(TRCT3)
$1N13744: C101.1 RJ45_2.1(TRCT3)
$1N13751: C100.1 RJ45_2.6(TRCT2)
$1N13756: C99.1 RJ45_2.7(TRCT4)
$1N13766: C102.2 RJ45_2.12(TRCT1)
$1N14002: C105.1 RJ45_1.1(TRCT3)
$1N14018: C106.2 RJ45_1.12(TRCT1)
$1N14025: C103.1 RJ45_1.7(TRCT4)
$1N14030: C104.1 RJ45_1.6(TRCT2)
$2N2036: R2.1 U1.63(RXD6_2)
$2N2037: R1.2 R27.2 U1.64(RXD6_1)
$2N2052: R21.2 U1.57(RX_CLK6/REFCLKO6)
$2N2080: R28.1 R29.1 U1.65(RXD6_0)
$2N2197: R4.2 U1.76(S_REXT)
$2N2247: R3.2 U1.127(ISET)
$2N7102: R25.1 U1.58(RX_DV6/CRS_DV6/RX_CTL6)
$2N9882: R42.2 U1.105(LED1_0)
$2N9909: R41.2 U1.106(LED1_1)
$2N9936: R43.2 U1.103(LED5_1)
$2N9963: R44.2 U1.92(LED2_1)
$2N9990: R45.2 U1.89(LED3_1)
$2N10041: R46.2 U1.86(LED4_1)
$2N10229: R47.2 U1.91(LED2_0)
$2N10232: R48.2 U1.85(LED4_0)
$2N61284: C19.1 U1.128(AVDDH)
$2N61291: C20.1 U1.122(AVDDH)
$2N61296: C21.1 U1.111(AVDDH)
$2N61305: C22.1 U1.44(AVDDH)
$2N61309: C23.1 U1.33(AVDDH)
$2N61317: C24.1 U1.22(AVDDH)
$2N61322: C25.1 U1.10(AVDDH)
$2N68076: C35.1 U1.99(VDDIO)
$2N68080: C32.1 U1.68(VDDIO)
$2N68085: C33.1 U1.61(VDDIO)
$2N68293: C26.1 U1.72(VDDHS)
$2N68297: C27.1 U1.83(VDDHS)
$2N68302: C31.1 U1.71(VDDLS)
$2N68309: C30.1 U1.84(VDDLS)
$2N102912: R49.1 U1.62(RXD6_3)
$3N903: R22.2 U2.91(PB11)
$3N915: R24.1 U2.105(PB13)
$3N918: R31.1 U2.193(PB4)
$3N924: R32.1 U2.194(PB5)
$3N50215: R23.1 U2.104(PB12)
$3N50277: R30.1 U2.192(PB3)
$3N51840: R19.2 U2.63(PB2)
$3N51998: U2.119(VCAPDSI) U2.125(VDD12DSI)
$3N52011: C109.1 U2.34(NRST)
$4N4119: R35.2 U12.2(COMP1)
$4N4145: R36.2 U12.7(COMP2)
$4N4195: C76.1 R35.1
$4N4305: R37.2 U12.3(FREQ)
$4N4400: C77.1 R36.1
$4N4552: R39.2 U12.10(V2SET)
$4N4575: C79.1 U12.11(SS2)
$4N4836: C82.1 U12.30(SS1)
$4N4878: R40.2 U12.31(V1SET)

Not connected (* = marked no-connect by the designer): R25 2; RJ45_1 13(-_1)* 14(+_1)* 15(-_2)* 16(+_2)*; RJ45_2 13(-_1)* 14(+_1)* 15(-_2)* 16(+_2)*; RJ45_3 13(-_1)* 14(+_1)* 15(-_2)* 16(+_2)*; RJ45_4 13(-_1)* 14(+_1)* 15(-_2)* 16(+_2)*; RJ45_5 13(-_1)* 14(+_1)* 15(-_2)* 16(+_2)*; U1 48(TX_CLK6/REFCLKI6) 50(TX_ER6)* 51(COL6)* 52(TXD6_3)* 53(TXD6_2)* 59(RX_ER6)* 60(CRS6)* 67(IBA)* 73(NC)* 74(NC)* 78(S_IN7M)* 79(S_IN7P)* 81(S_OUT7P)* 82(S_OUT7M)* 88(LED3_0)* 90(GPIO_1)* 95(SYNCLKO)* 102(LED5_0)* 108(NC)* 125(XO)*; U2 1(PE2)* 2(PE3)* 3(PE4)* 4(PE5)* 5(PE6)* 7(PI8)* 8(PC13)* 9(PC14)* 10(PC15)* 11(Pl9)* 12(Pl10)* 13(Pl11)* 16(PF0)* 17(PF1)* 18(PF2)* 19(Pl12)* 20(Pl13)* 21(PI14)* 22(PF3)* 23(PF4)* 24(PF5)* 27(PF6)* 28(PF7)* 29(PF8)* 30(PF9)* 31(PF10)* 33(PH1/OSCOUT)* 35(PC0)* 36(PC1)* 37(PC2)* 38(PC3)* 43(PA0)* 45(PA2)* 46(PH2)* 47(PH3)* 48(PH4)* 49(PH5)* 50(PA3)* 54(PA5)* 55(PA6)* 61(PB0)* 62(PB1)* 64(PI15)* 65(PJ0)* 66(PJ1)* 67(PJ2)* 68(PJ3)* 69(PJ4)* 70(PF11)* 71(PF12)* 74(PF13)* 75(PF14)* 76(PF15)* 77(PG0)* 78(PG1)* 79(PE7)* 80(PE8)* 81(PE9)* 84(PE10)* 85(PE11)* 86(PE12)* 87(PE13)* 88(PE14)* 89(PE15)* 90(PB10)* 95(PJ5)* 96(PH6)* 97(PH7)* 98(PH8)* 99(PH9)* 100(PH10)* 101(PH11)* 102(PH12)* 108(PD8)* 109(PD9)* 110(PD10)* 111(PD11)* 112(PD12)* 113(PD13)* 116(PD14)* 117(PD15)* 120(DSIHOST_D0P)* 121(DSIHOST_D0N)* 123(DSIHOST_CKP)* 124(DSIHOST_CKN)* 126(DSIHOST_D1P)* 127(DSIHOST_D1N)* 129(PG2)* 130(PG3)* 131(PG4)* 132(PG5)* 133(PG6)* 134(PG7)* 135(PG8)* 138(PC6)* 139(PC7)* 140(PC8)* 141(PC9)* 142(PA8)* 143(PA9)* 144(PA10)* 147(PA13)* 151(PH13)* 152(PH14)* 153(PH15)* 154(PI0)* 155(PI1)* 156(PI2)* 157(P13)* 159(PA14)* 160(PA15)* 161(PC10)* 162(PC11)* 163(PC12)* 165(PD1)* 166(PD2)* 167(PD3)* 168(PD4)* 169(PD5)* 172(PD6)* 173(PD7)* 174(PJ12)* 175(PJ13)* 176(PJ14)* 177(PJ15)* 178(PG9)* 179(PG10)* 180(PG11)* 181(PG12)* 182(PG13)* 183(PG14)* 186(PK3)* 187(PK4)* 188(PK5)* 189(PK6)* 190(PK7)* 191(PG15)* 195(PB6)* 196(PB7)* 198(PE8)* 199(PE9)* 200(PE0)* 201(PE1)* 205(Pl4)* 206(PI5)* 207(PI6)* 208(PI7)*; U12 12(PGOOD2)* 29(PGOOD1)*; USB1 3(SBU2)* 9(SBU1)*

## Notes on the sheets
sheet 1
- RJ45 Ports
sheet 2
- Oscilator
- Switch IC
- System & Clocks
- Strap configuration
- Power
- SGMII
- RJ45 ports
- SPI
- RMII
sheet 3
- Oscilator
- MCU
- Signals
- System & Clocks
- BOOT Button
- VDDA & VREF
- DSI
- Power
sheet 4
- LDO and Buck
- Inductors
sheet 5
- USB + ESD
